# EAGLE design Sensor_Projekt_board_fertig_V1004 (EAGLE 9.6.1)

## Sheet 1 of 11: Spannungsversorgung
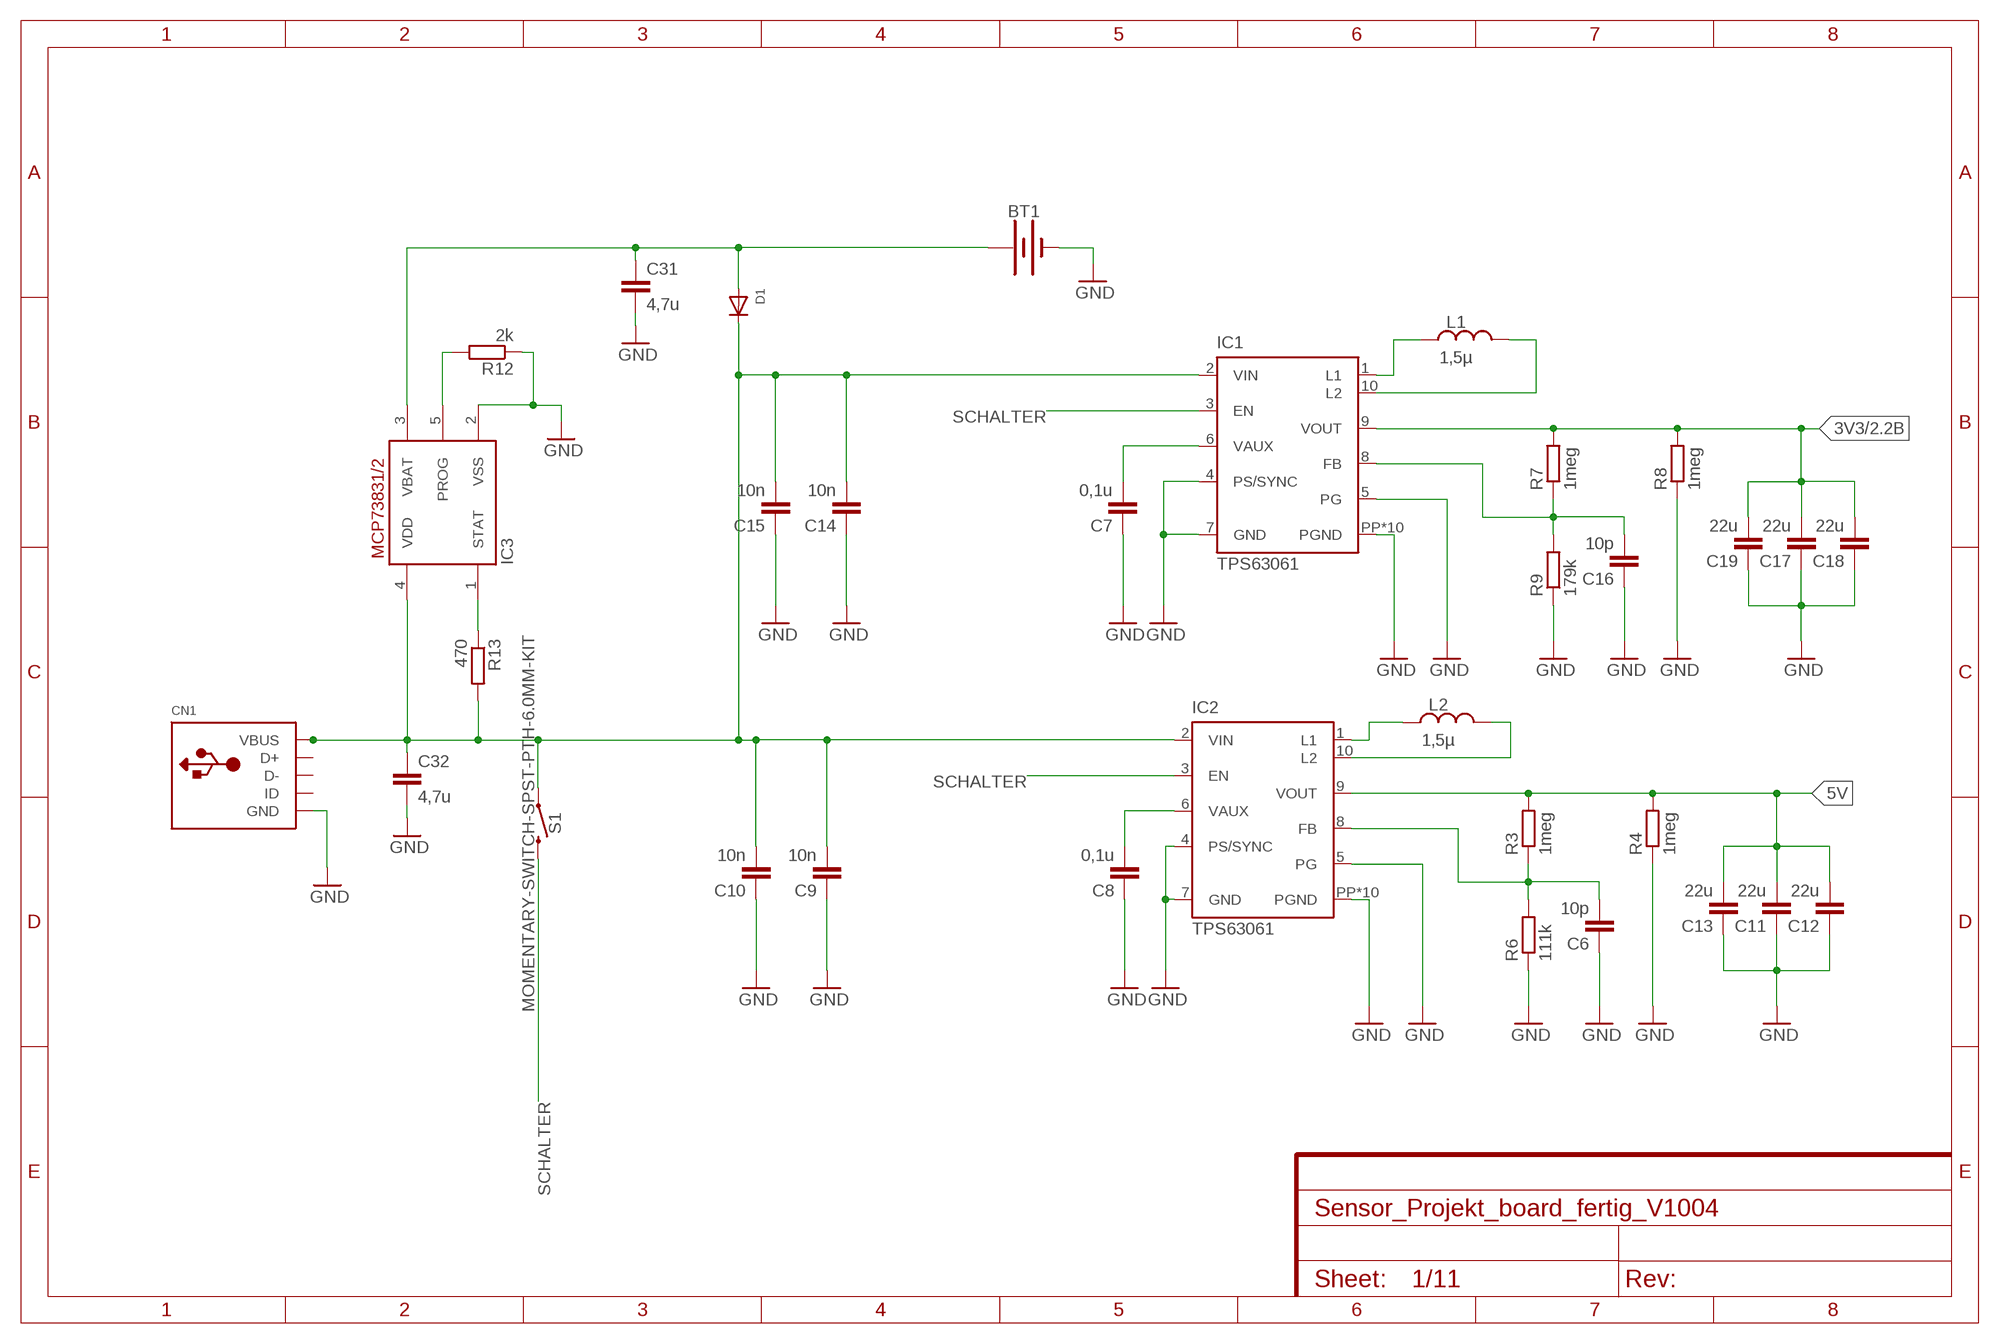
[diagram p0: schematic, sheet 1]

### Parts
BT1  BATTERY-18650  [BATTERY_18650-HOLDER]
C6  10p  C-EUC0603  [C0603]
C7  0,1u  C-EUC0603  [C0603]
C8  0,1u  C-EUC0603  [C0603]
C9  10n  C-EUC0603  [C0603]
C10  10n  C-EUC0603  [C0603]
C11  22u  C-EUC0603  [C0603]
C12  22u  C-EUC0603  [C0603]
C13  22u  C-EUC0603  [C0603]
C14  10n  C-EUC0603  [C0603]
C15  10n  C-EUC0603  [C0603]
C16  10p  C-EUC0603  [C0603]
C17  22u  C-EUC0603  [C0603]
C18  22u  C-EUC0603  [C0603]
C19  22u  C-EUC0603  [C0603]
C31  4,7u  C-EUC0603  [C0603]
C32  4,7u  C-EUC0603  [C0603]
CN1  USBTHM  [USB-MINIB-THM]
D1  DIODE_SOD-123FL  [SOD-123FL]
IC1  TPS63061  [DSC-S-PWSON-N10]
IC2  TPS63061  [DSC-S-PWSON-N10]
IC3  MCP73831/OT  [SOT23-5L]
L1  1,5µ  L_CHIP-1008(2520-METRIC)  [INDC2520X120N]
L2  1,5µ  L_CHIP-1008(2520-METRIC)  [INDC2520X120N]
R3  1meg  R-EU_R0603  [R0603]
R4  1meg  R-EU_R0603  [R0603]
R6  111k  R-EU_R0603  [R0603]
R7  1meg  R-EU_R0603  [R0603]
R8  1meg  R-EU_R0603  [R0603]
R9  179k  R-EU_R0603  [R0603]
R12  2k  R-EU_R0603  [R0603]
R13  470  R-EU_R0603  [R0603]
S1  MOMENTARY-SWITCH-SPST-PTH-6.0MM-KIT  [TACTILE_SWITCH_PTH_6.0MM_KIT]

### Nets
3V3: C17.2 C18.2 C19.2 IC1.9(VOUT) R7.2 R8.2 ; also sheet 2,3,4,5,7,8,11
5V: C11.2 C12.2 C13.2 IC2.9(VOUT) R3.2 R4.2 ; also sheet 6,9,10
GND: BT1.GND@1(-) C6.1 C7.1 C8.1 C9.1 C10.1 C11.1 C12.1 C13.1 C14.1 C15.1 C16.1 C17.1 C18.1 C19.1 C31.2 C32.2 CN1.GND IC1.4(PS/SYNC) IC1.7(GND) IC1.PP(PGND) IC1.PP@1(PGND) IC1.PP@2(PGND) IC1.PP@3(PGND) IC1.PP@4(PGND) IC1.PP@5(PGND) IC1.PP@7(PGND) IC1.PP@8(PGND) IC1.PP@9(PGND) IC1.PP@10(PGND) IC2.4(PS/SYNC) IC2.5(PG) IC2.7(GND) IC2.PP(PGND) IC2.PP@1(PGND) IC2.PP@2(PGND) IC2.PP@3(PGND) IC2.PP@4(PGND) IC2.PP@5(PGND) IC2.PP@7(PGND) IC2.PP@8(PGND) IC2.PP@9(PGND) IC2.PP@10(PGND) IC3.2(VSS) R4.1 R6.1 R8.1 R9.1 R12.1 ; also sheet 2,3,4,5,6,7,8,9,10,11
N$2: IC3.5(PROG) R12.2
N$3: BT1.PWR@1(+) C31.1 D1.A IC3.3(VBAT)
N$4: C8.2 IC2.6(VAUX)
N$5: C7.2 IC1.6(VAUX)
N$6: C9.2 C10.2 C14.2 C15.2 C32.1 CN1.VBUS D1.C IC1.2(VIN) IC2.2(VIN) IC3.4(VDD) R13.2 S1.1
N$7: IC2.10(L2) L2.2
N$8: IC1.1(L1) L1.1
N$9: IC1.10(L2) L1.2
N$10: C6.2 IC2.8(FB) R3.1 R6.2
N$11: C16.2 IC1.8(FB) R7.1 R9.2
N$12: IC1.5(PG) ; supply symbol labelled GND
N$13: IC2.1(L1) L2.1
N$14: IC3.1(STAT) R13.1
SCHALTER: IC1.3(EN) IC2.3(EN) S1.3 ; also sheet 2
Unconnected: CN1.D+ CN1.D- CN1.ID

## Sheet 2 of 11: ESP32
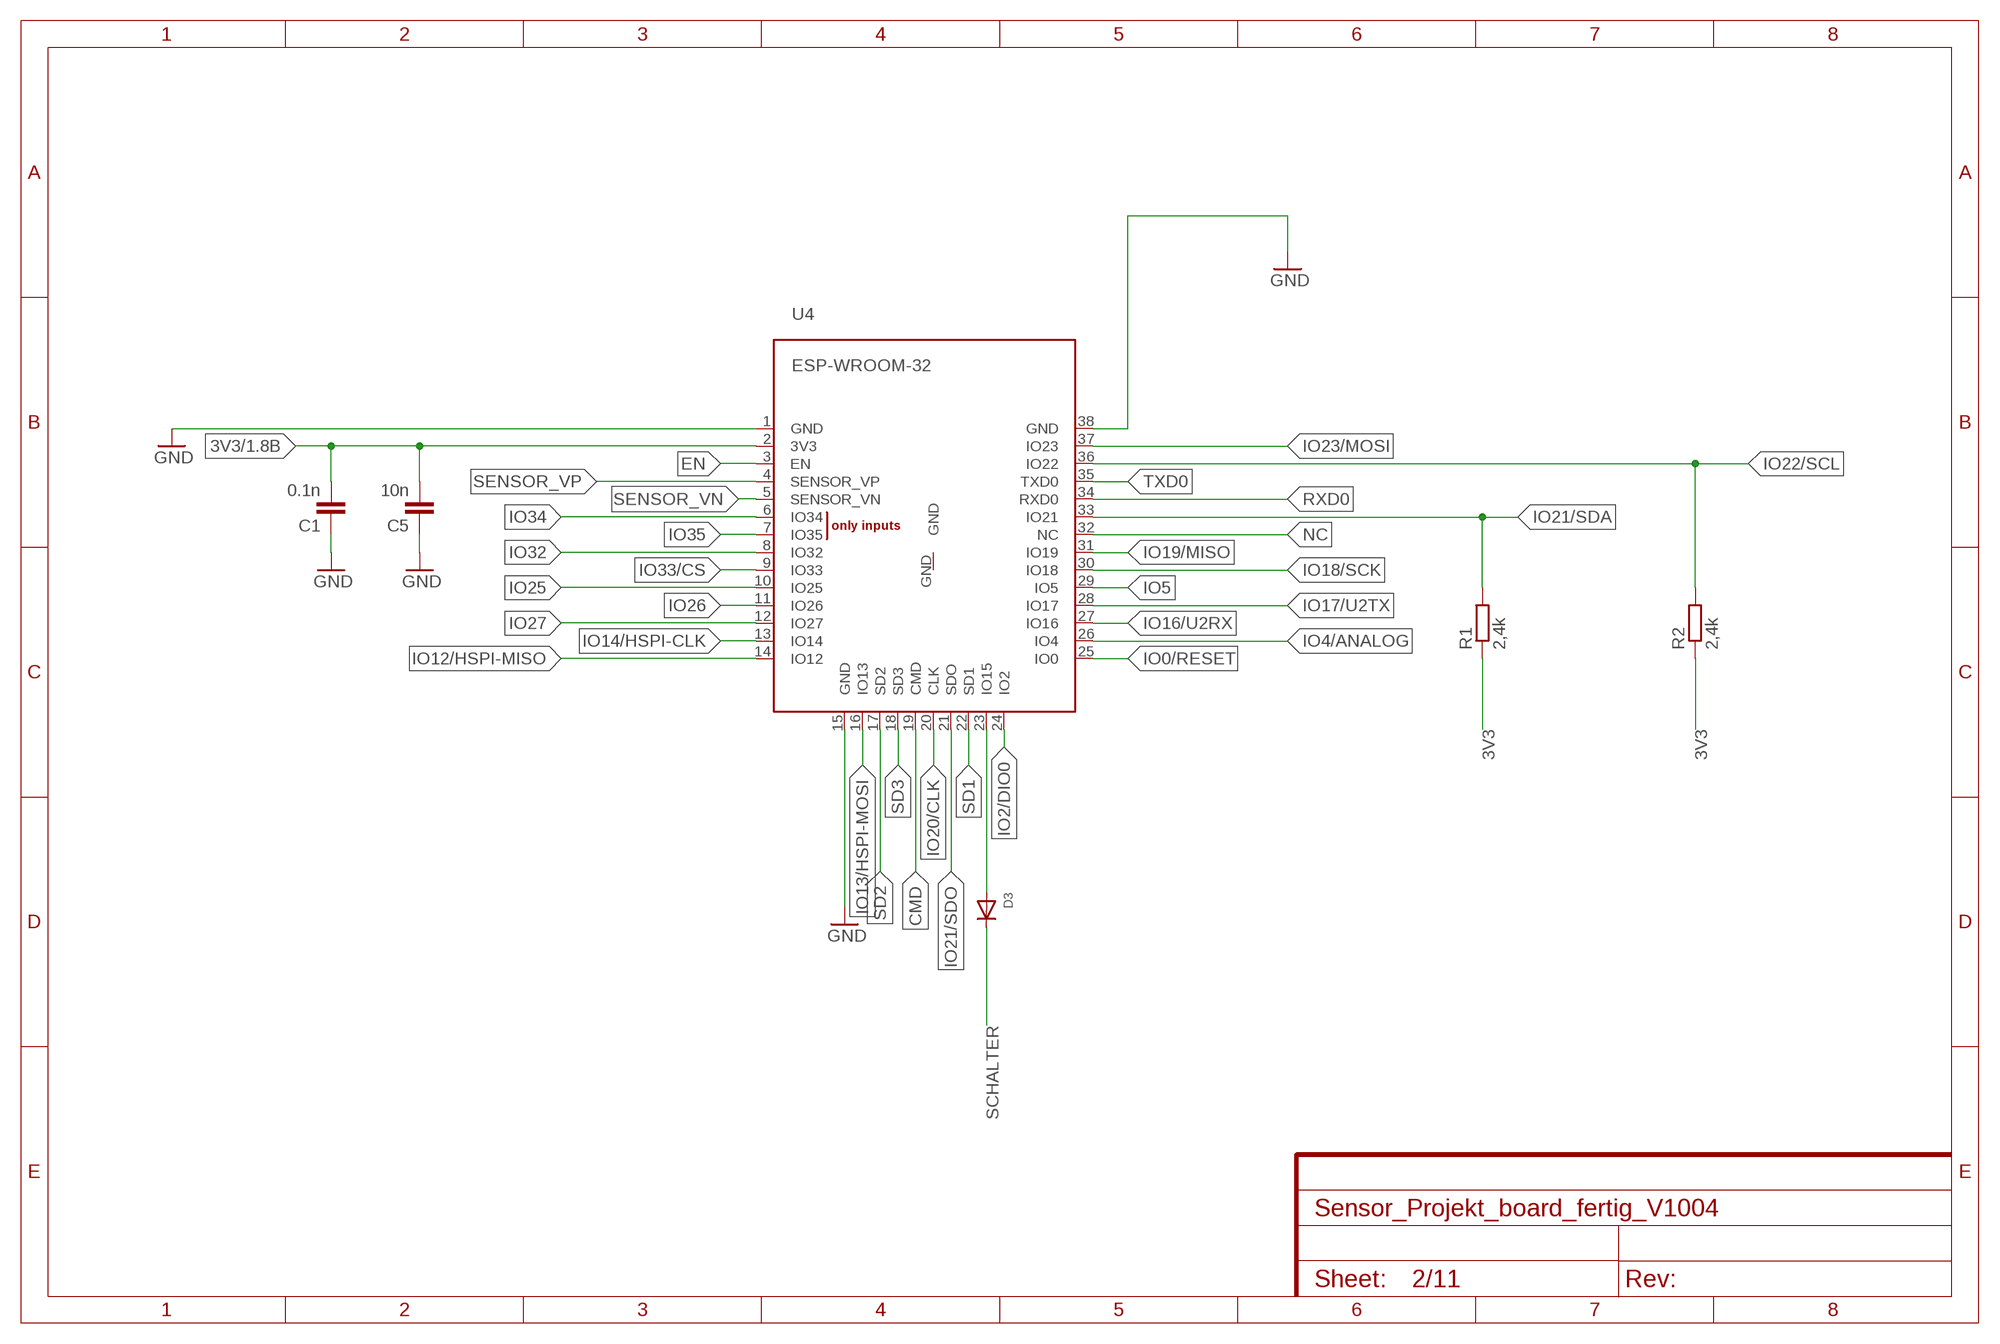
[diagram p1: schematic, sheet 2]

### Parts
C1  0.1n  C-EUC0603  [C0603]
C5  10n  C-EUC0603  [C0603]
D3  DIODE_SOD-123FL  [SOD-123FL]
R1  2,4k  R-EU_R0603  [R0603]
R2  2,4k  R-EU_R0603  [R0603]
U4  ESP-WROOM-32  [ESP-WROOM-32]

### Nets
3V3: C1.2 C5.2 R1.1 R2.1 U4.2(3V3) ; also sheet 1,3,4,5,7,8,11
CMD: U4.19(CMD)
EN: U4.3(EN)
GND: C1.1 C5.1 U4.1(GND) U4.15(GND) U4.38(GND) ; also sheet 1,3,4,5,6,7,8,9,10,11
IO0/RESET: U4.25(IO0) ; also sheet 7
IO2/DIO0: U4.24(IO2) ; also sheet 7
IO4/ANALOG: U4.26(IO4) ; also sheet 6
IO5: U4.29(IO5) ; also sheet 7
IO12/HSPI-MISO: U4.14(IO12) ; also sheet 8
IO13/HSPI-MOSI: U4.16(IO13) ; also sheet 8
IO14/HSPI-CLK: U4.13(IO14) ; also sheet 8
IO15/VCC_ENABLE: D3.A U4.23(IO15)
IO16/U2RX: U4.27(IO16) ; also sheet 9
IO17/U2TX: U4.28(IO17)
IO18/SCK: U4.30(IO18) ; also sheet 7
IO19/MISO: U4.31(IO19) ; also sheet 7
IO20/CLK: U4.20(CLK)
IO21/SDA: R1.2 U4.33(IO21) ; also sheet 3,5,10,11
IO21/SDO: U4.21(SDO)
IO22/SCL: R2.2 U4.36(IO22) ; also sheet 3,5,10,11
IO23/MOSI: U4.37(IO23) ; also sheet 7
IO25: U4.10(IO25)
IO26: U4.11(IO26)
IO27: U4.12(IO27)
IO32: U4.8(IO32)
IO33/CS: U4.9(IO33) ; also sheet 8
IO34: U4.6(IO34)
IO35: U4.7(IO35)
NC: U4.32(NC)
RXD0: U4.34(RXD0) ; also sheet 4
SCHALTER: D3.C ; also sheet 1
SD1: U4.22(SD1)
SD2: U4.17(SD2)
SD3: U4.18(SD3)
SENSOR_VN: U4.5(SENSOR_VN)
SENSOR_VP: U4.4(SENSOR_VP)
TXD0: U4.35(TXD0) ; also sheet 4
Unconnected: U4.GND

## Sheet 3 of 11: Temp-Hum-Pres-BME280
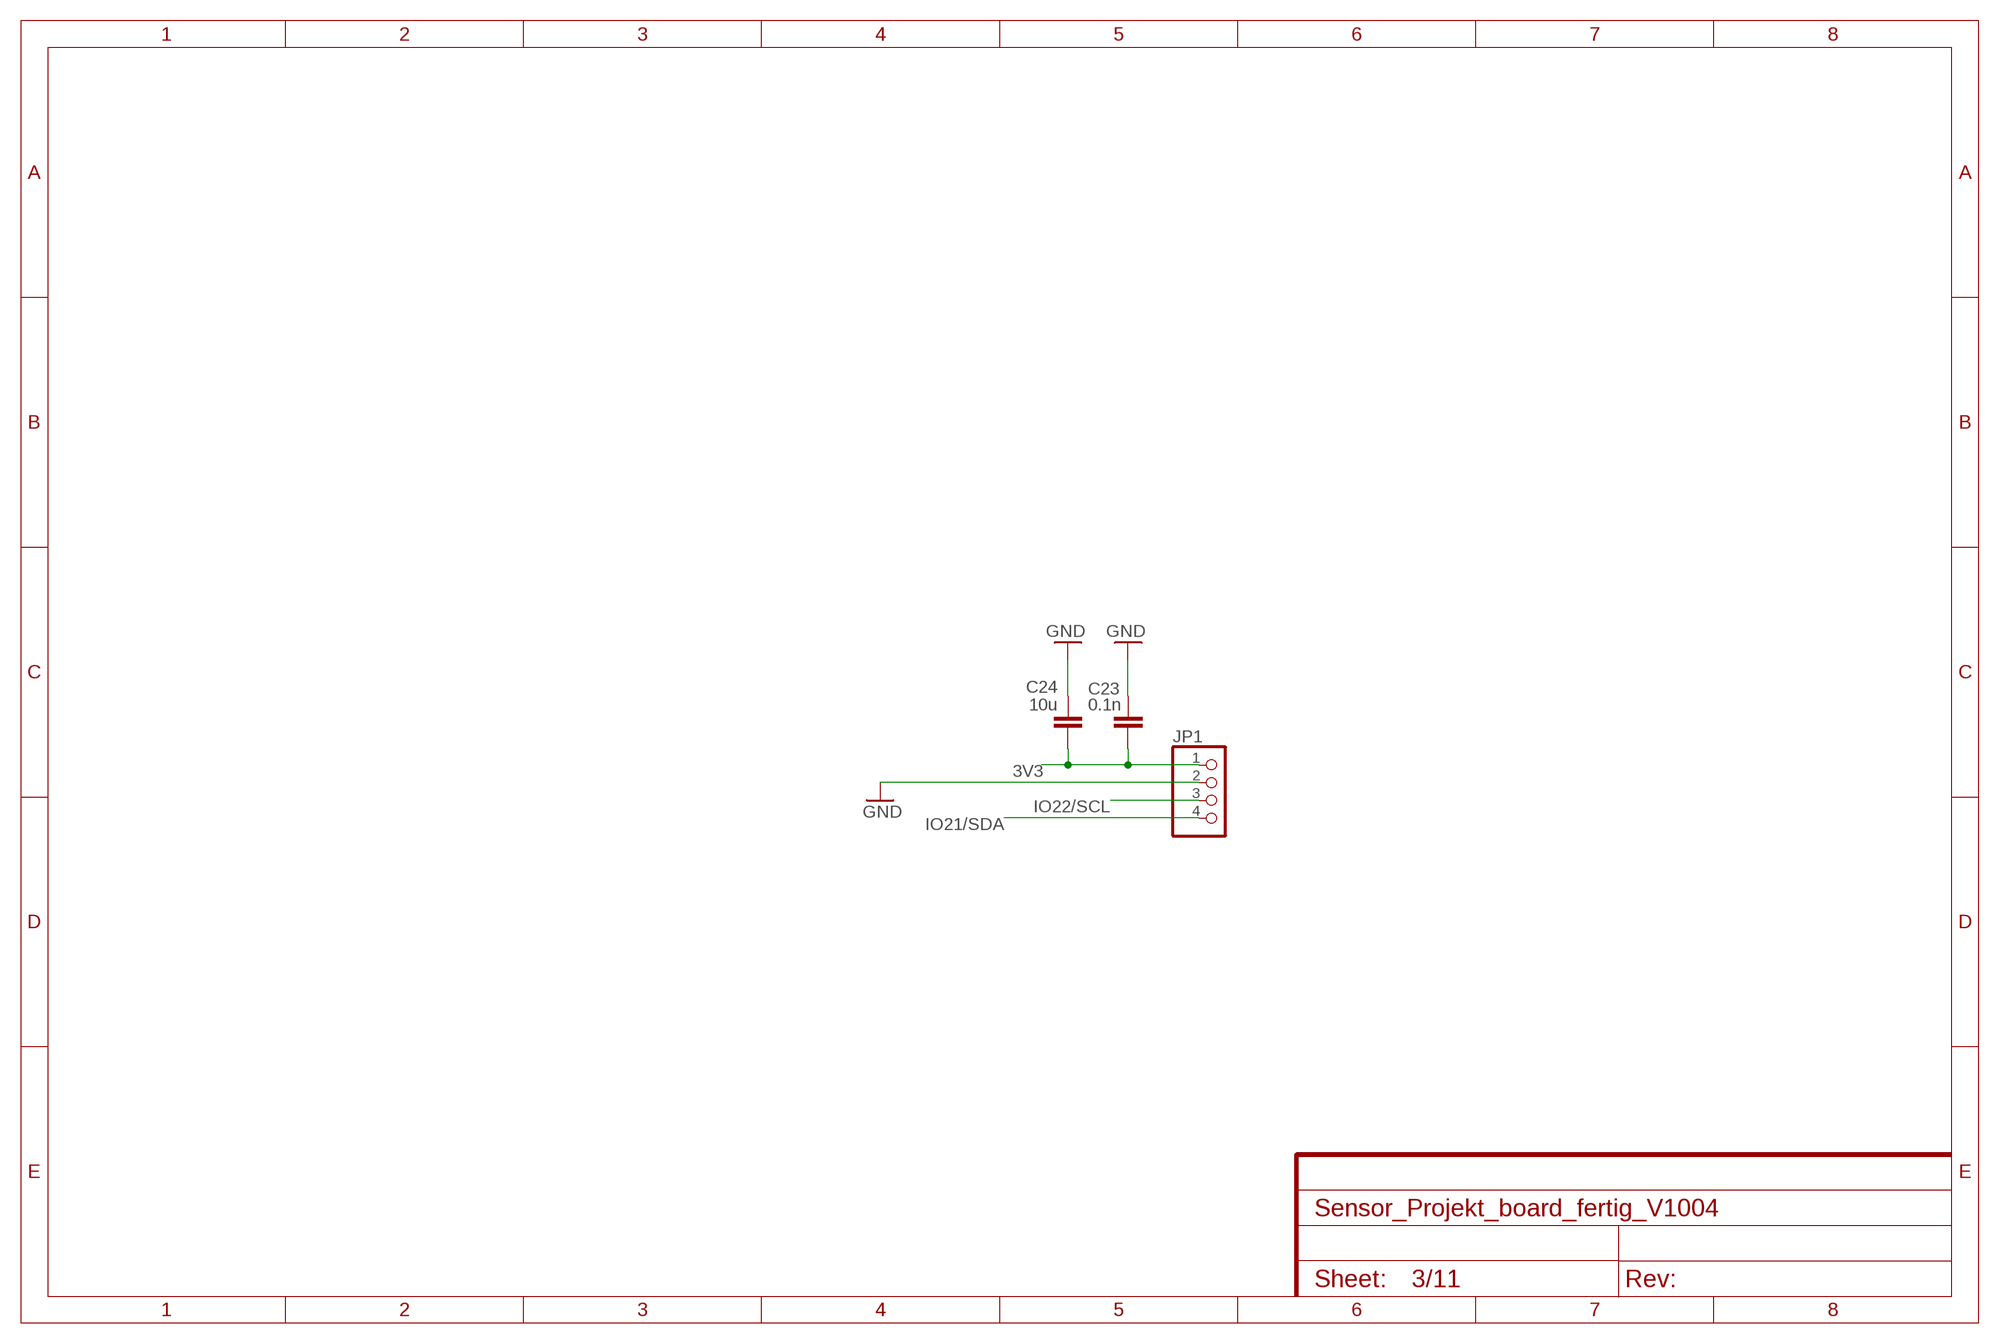
[diagram p2: schematic, sheet 3]

### Parts
C23  0.1n  C-EUC0603  [C0603]
C24  10u  C-EUC0603  [C0603]
JP1  PINHD-1X4  [1X04]

### Nets
3V3: C23.1 C24.1 JP1.1 ; also sheet 1,2,4,5,7,8,11
GND: C23.2 C24.2 JP1.2 ; also sheet 1,2,4,5,6,7,8,9,10,11
IO21/SDA: JP1.4 ; also sheet 2,5,10,11
IO22/SCL: JP1.3 ; also sheet 2,5,10,11

## Sheet 4 of 11: USB_Anschluss
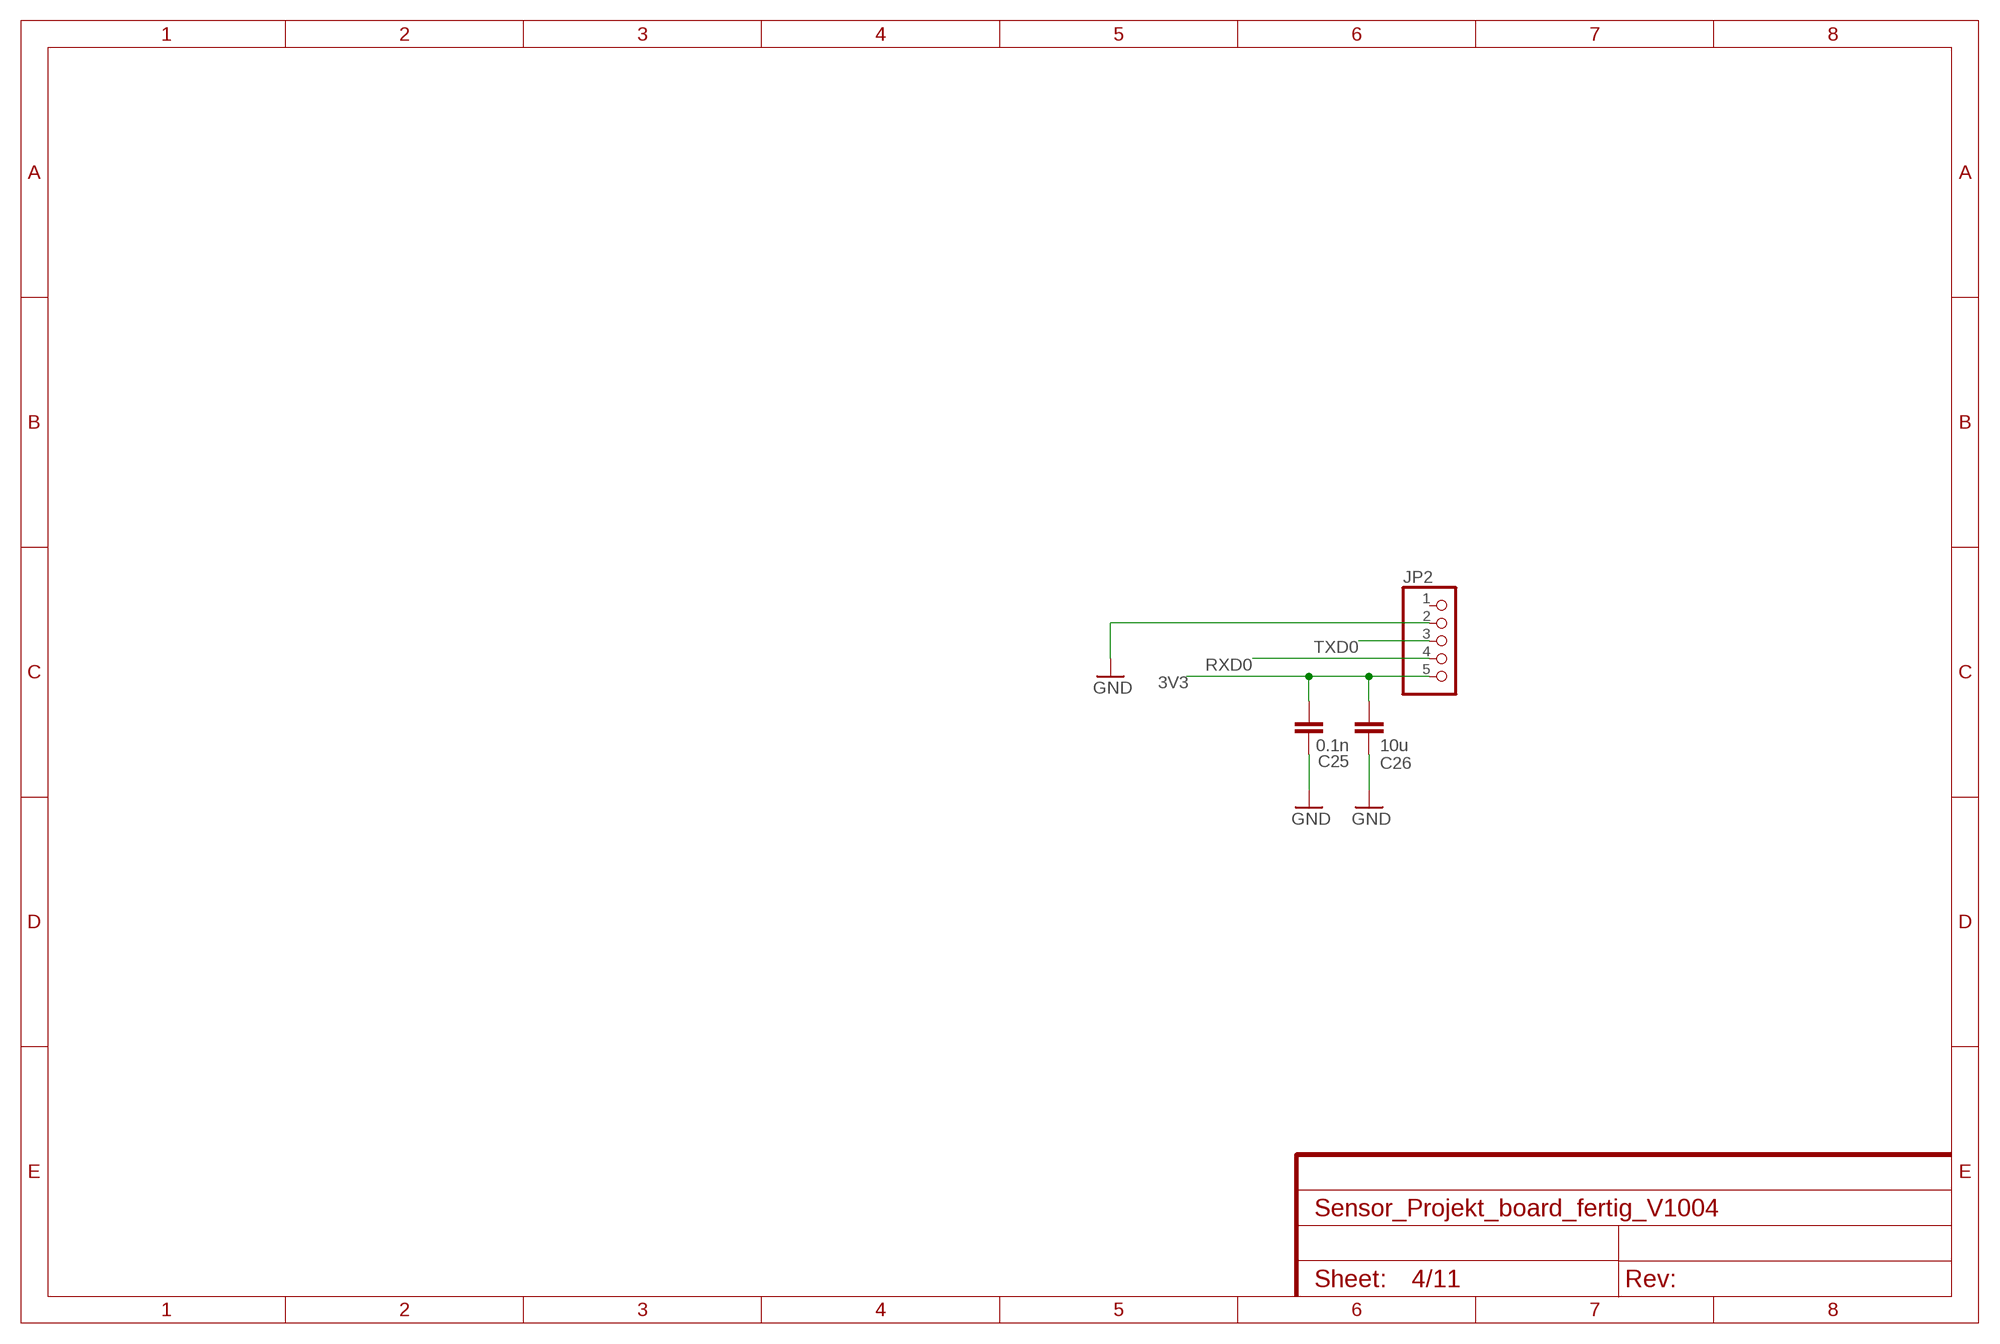
[diagram p3: schematic, sheet 4]

### Parts
C25  0.1n  C-EUC0603  [C0603]
C26  10u  C-EUC0603  [C0603]
JP2  PINHD-1X5  [1X05]

### Nets
3V3: C25.1 C26.1 JP2.5 ; also sheet 1,2,3,5,7,8,11
GND: C25.2 C26.2 JP2.2 ; also sheet 1,2,3,5,6,7,8,9,10,11
RXD0: JP2.4 ; also sheet 2
TXD0: JP2.3 ; also sheet 2
Unconnected: JP2.1

## Sheet 5 of 11: Display
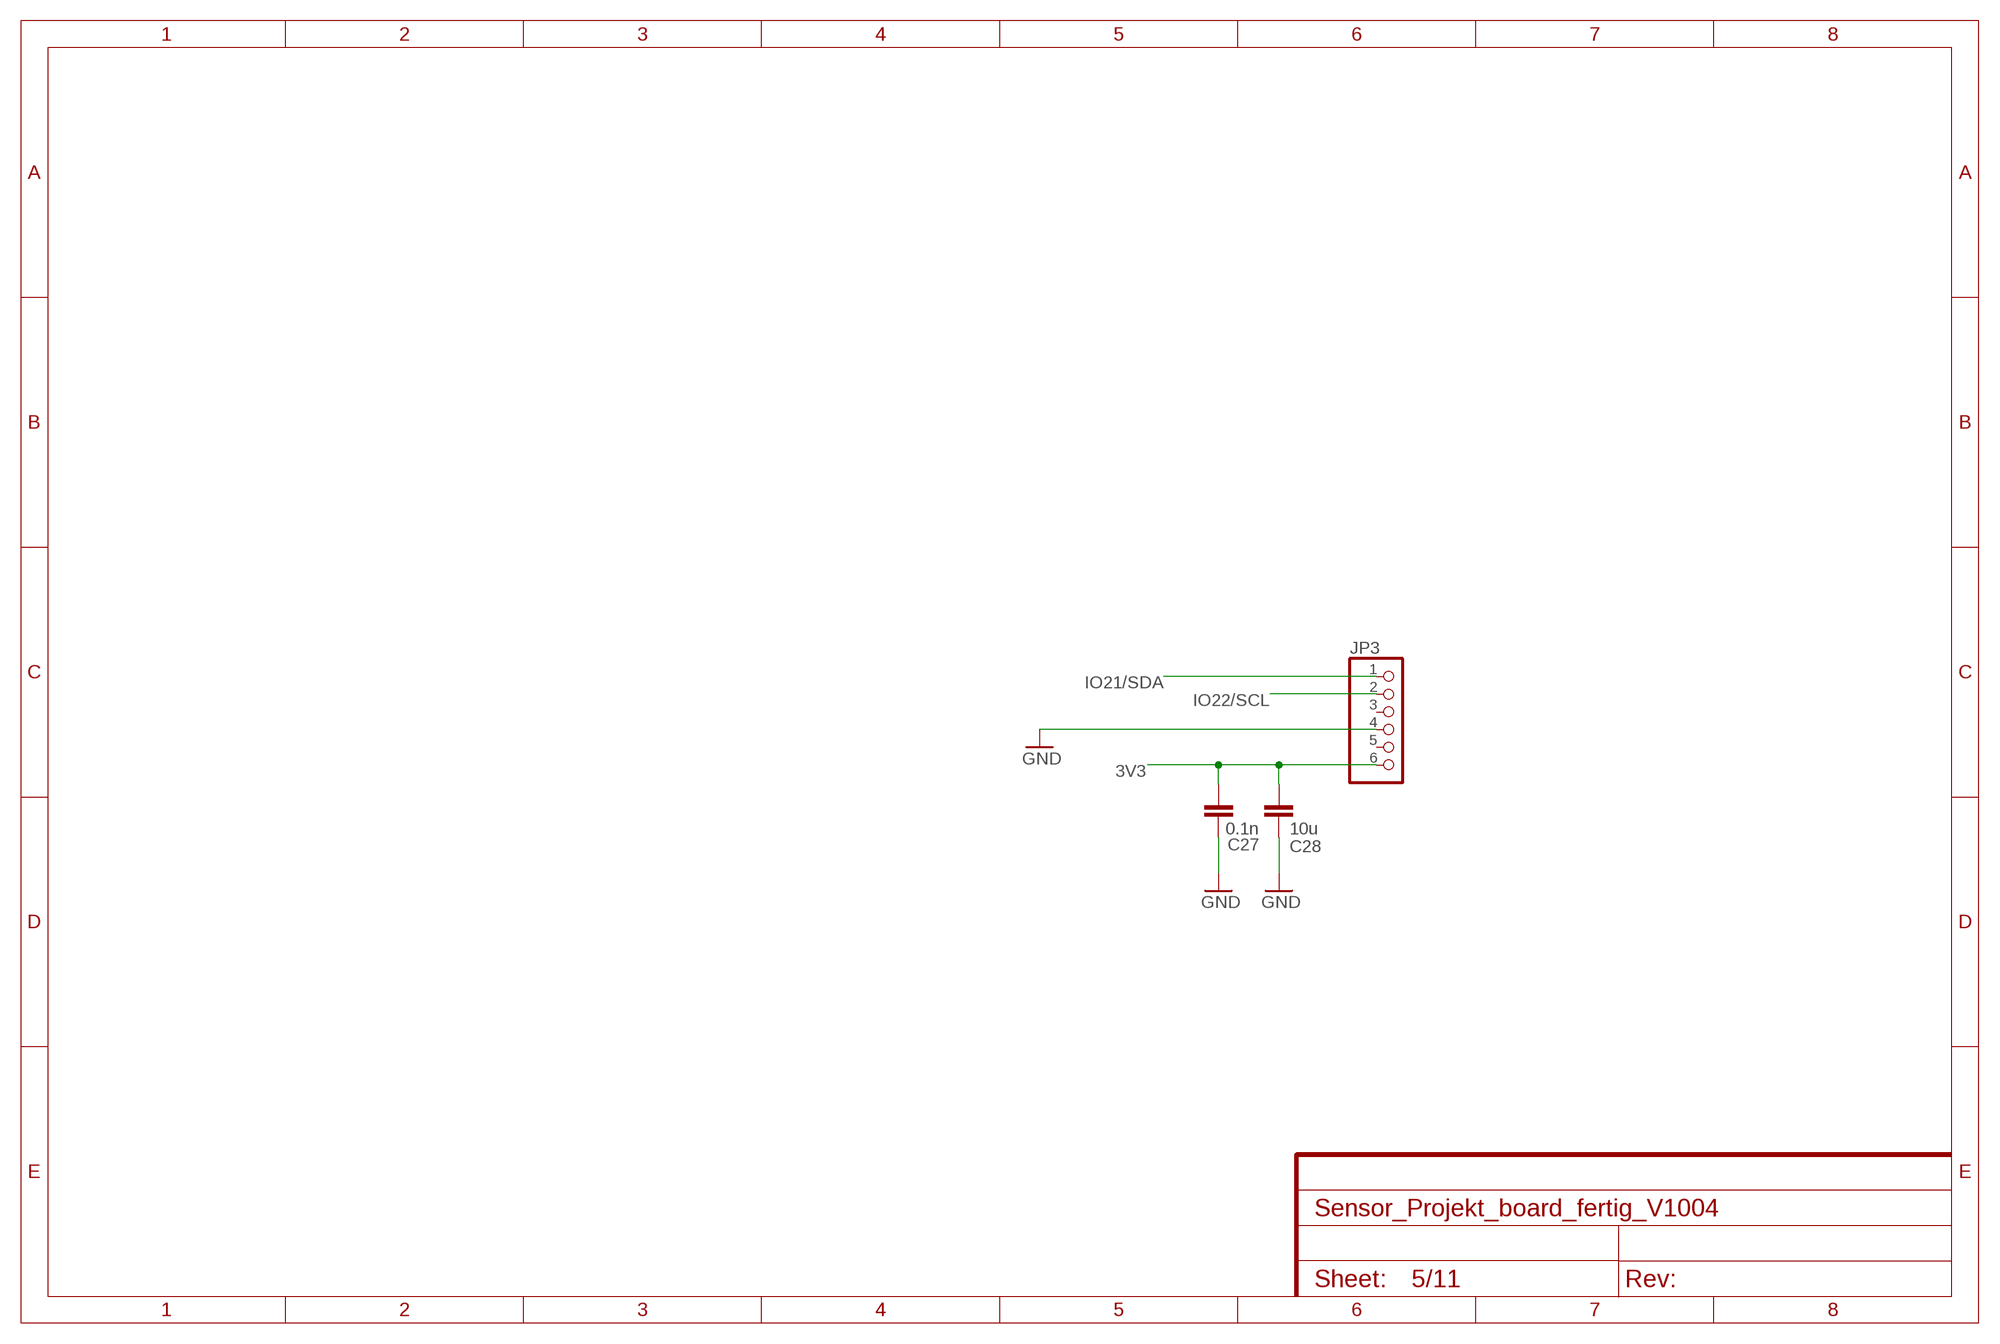
[diagram p4: schematic, sheet 5]

### Parts
C27  0.1n  C-EUC0603  [C0603]
C28  10u  C-EUC0603  [C0603]
JP3  PINHD-1X6  [1X06]

### Nets
3V3: C27.1 C28.1 JP3.6 ; also sheet 1,2,3,4,7,8,11
GND: C27.2 C28.2 JP3.4 ; also sheet 1,2,3,4,6,7,8,9,10,11
IO21/SDA: JP3.1 ; also sheet 2,3,10,11
IO22/SCL: JP3.2 ; also sheet 2,3,10,11
Unconnected: JP3.3 JP3.5

## Sheet 6 of 11: Gassensor MQ135
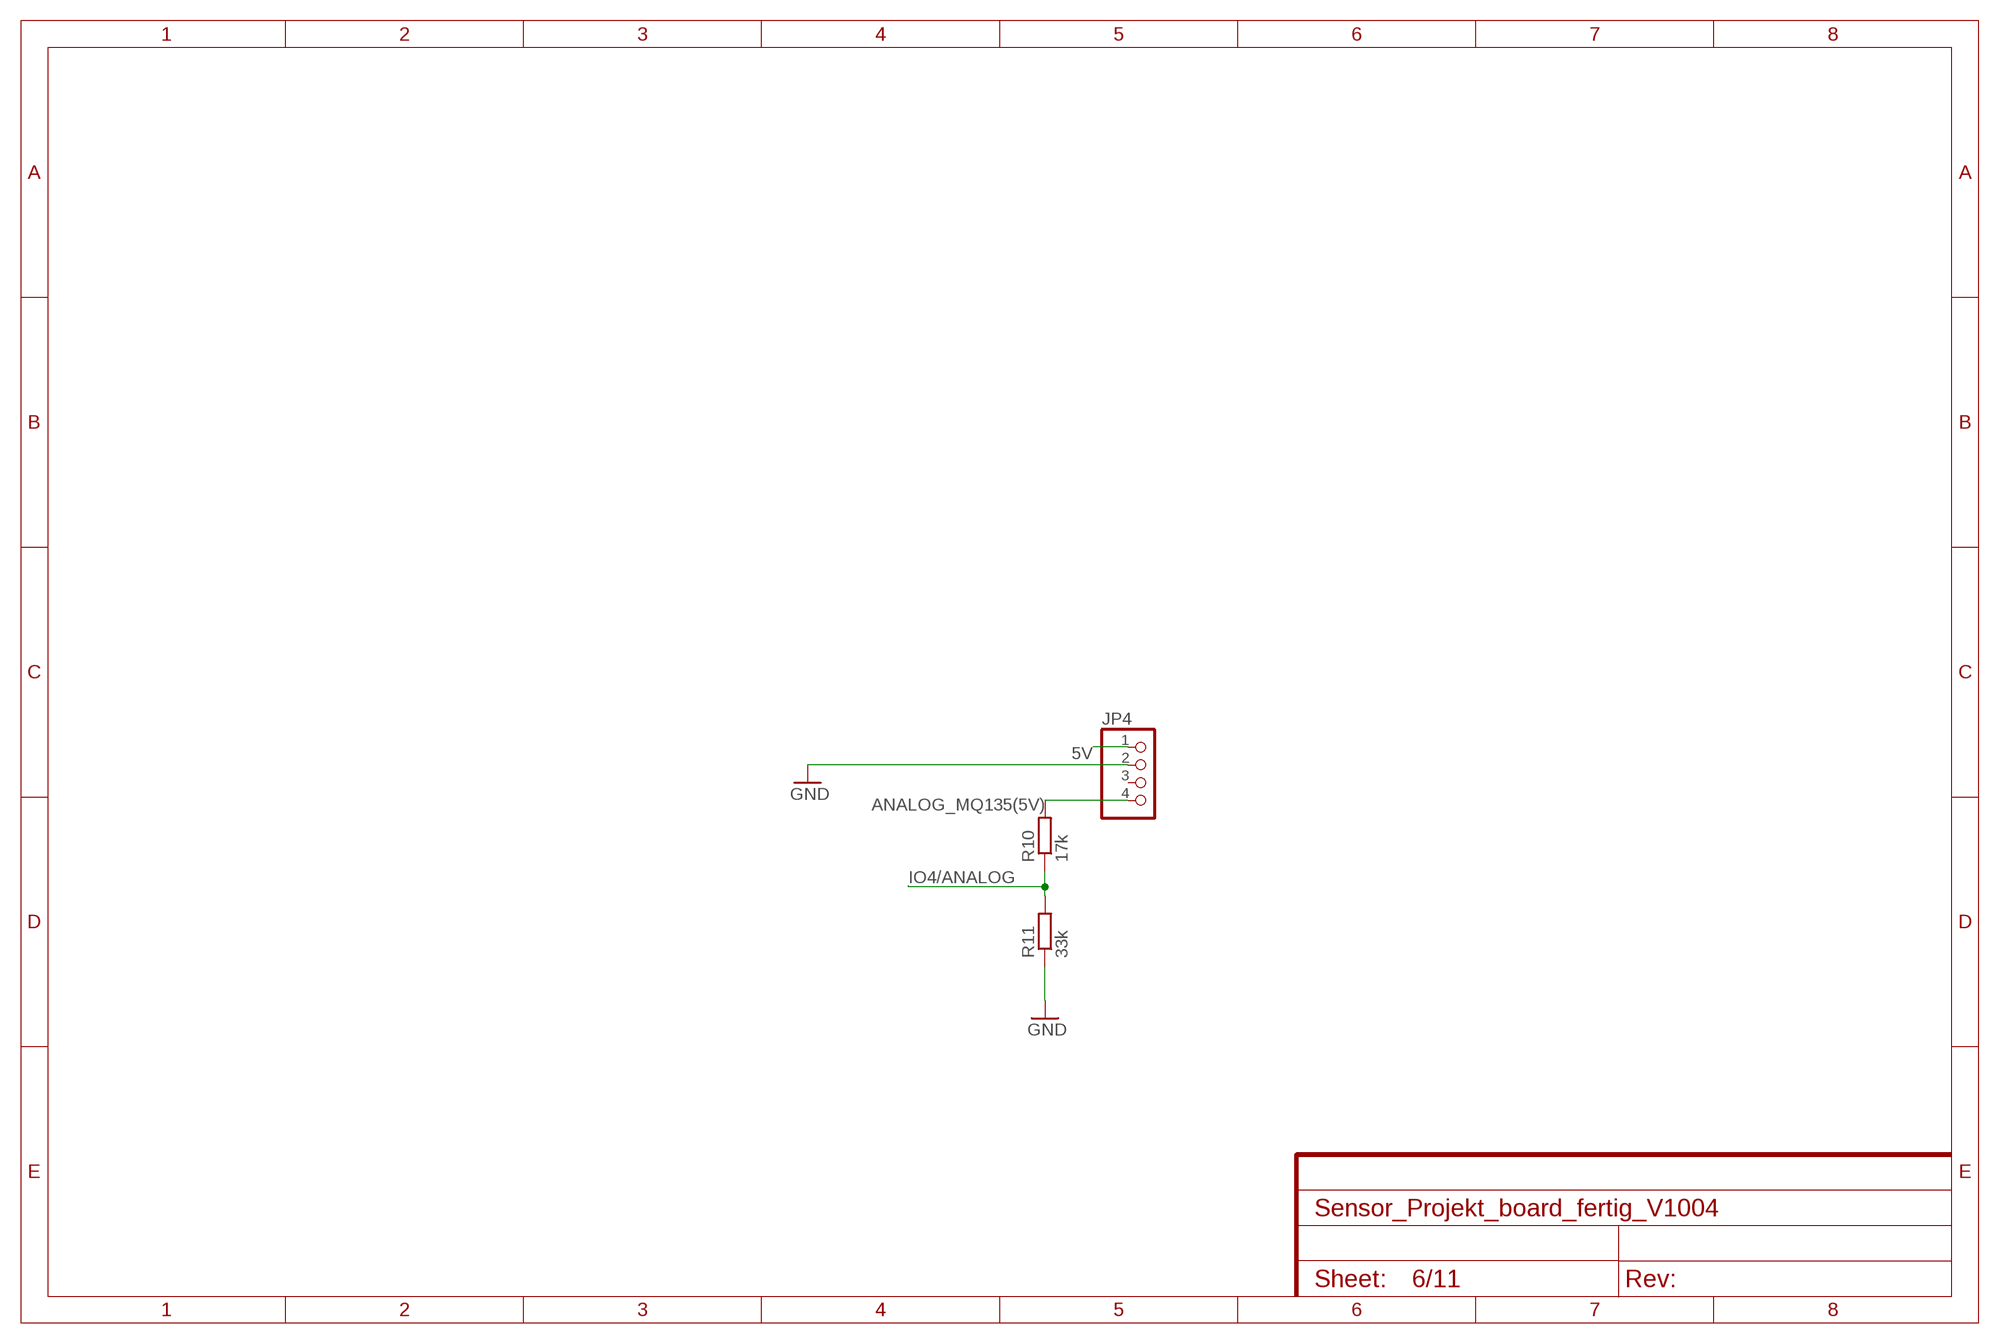
[diagram p5: schematic, sheet 6]

### Parts
JP4  PINHD-1X4  [1X04]
R10  17k  R-EU_R0603  [R0603]
R11  33k  R-EU_R0603  [R0603]

### Nets
5V: JP4.1 ; also sheet 1,9,10
ANALOG_MQ135(5V): JP4.4 R10.2
GND: JP4.2 R11.1 ; also sheet 1,2,3,4,5,7,8,9,10,11
IO4/ANALOG: R10.1 R11.2 ; also sheet 2
Unconnected: JP4.3

## Sheet 7 of 11: LORA-Modul
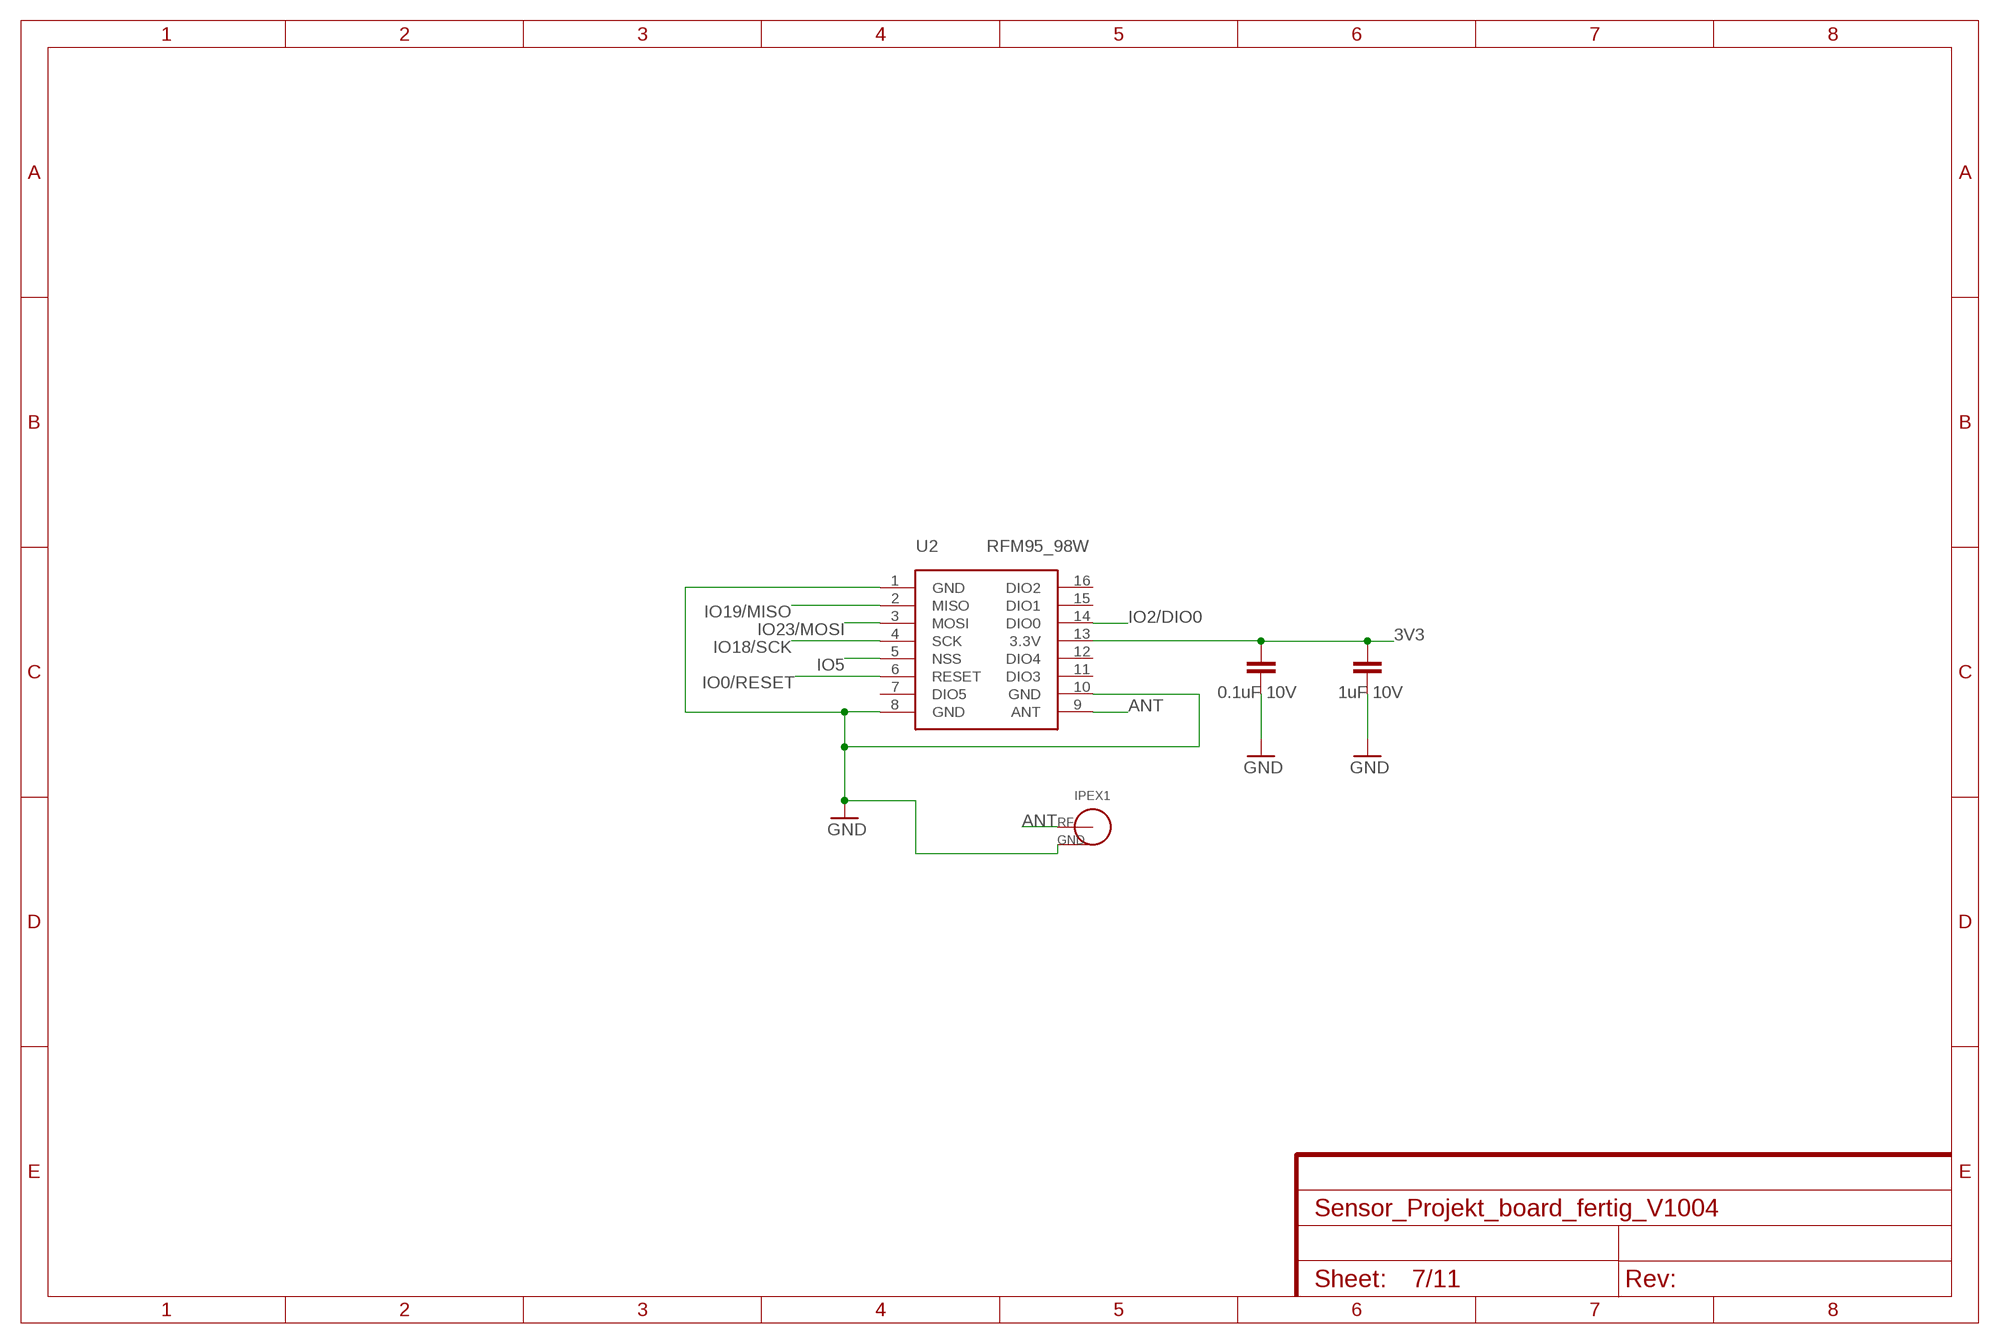
[diagram p6: schematic, sheet 7]

### Parts
C4  0.1uF 10V  C-EUC0402  [C0402]
C20  1uF 10V  C-EUC0402  [C0402]
IPEX1  I-PEX  [I-PEX]
U2  RFM95_98W  [RFM95_98W]

### Nets
3V3: C4.2 C20.2 U2.13(3.3V) ; also sheet 1,2,3,4,5,8,11
ANT: IPEX1.SIG U2.9(ANT)
GND: C4.1 C20.1 IPEX1.GND IPEX1.GND1(GND) U2.1(GND) U2.8(GND) U2.10(GND) ; also sheet 1,2,3,4,5,6,8,9,10,11
IO0/RESET: U2.6(RESET) ; also sheet 2
IO2/DIO0: U2.14(DIO0) ; also sheet 2
IO5: U2.5(NSS) ; also sheet 2
IO18/SCK: U2.4(SCK) ; also sheet 2
IO19/MISO: U2.2(MISO) ; also sheet 2
IO23/MOSI: U2.3(MOSI) ; also sheet 2
Unconnected: U2.7(DIO5) U2.11(DIO3) U2.12(DIO4) U2.15(DIO1) U2.16(DIO2)

## Sheet 8 of 11: SD-Karte
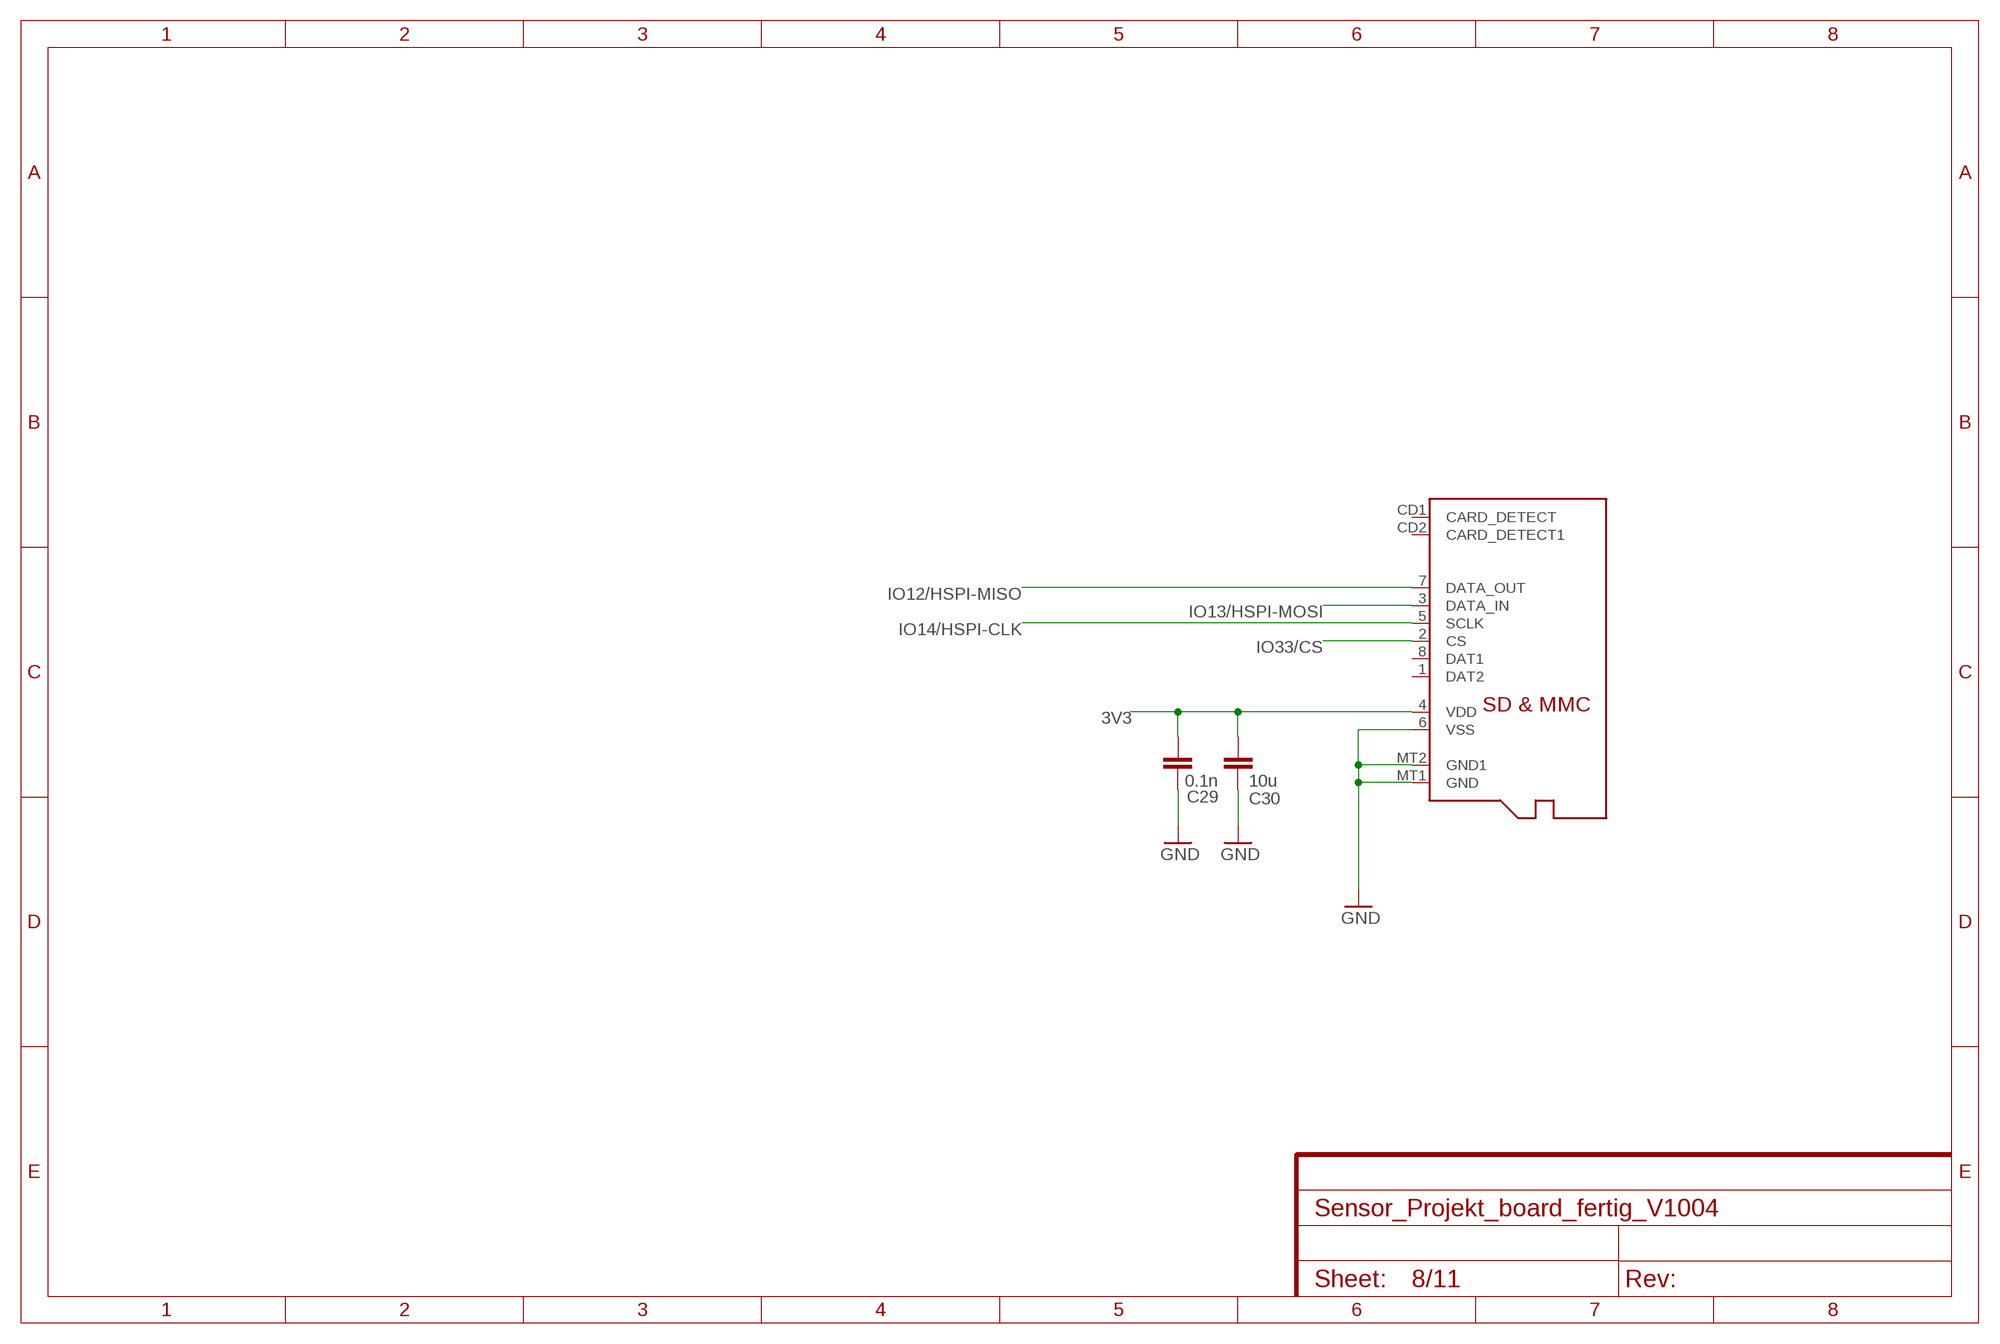
[diagram p7: schematic, sheet 8]

### Parts
C29  0.1n  C-EUC0603  [C0603]
C30  10u  C-EUC0603  [C0603]
U$16  MICROSD  [MICROSD]

### Nets
3V3: C29.1 C30.1 U$16.4(VDD) ; also sheet 1,2,3,4,5,7,11
GND: C29.2 C30.2 U$16.6(VSS) U$16.MT1(GND) U$16.MT2(GND1) ; also sheet 1,2,3,4,5,6,7,9,10,11
IO12/HSPI-MISO: U$16.7(DATA_OUT) ; also sheet 2
IO13/HSPI-MOSI: U$16.3(DATA_IN) ; also sheet 2
IO14/HSPI-CLK: U$16.5(SCLK) ; also sheet 2
IO33/CS: U$16.2(CS) ; also sheet 2
Unconnected: U$16.1(DAT2) U$16.8(DAT1) U$16.CD1(CARD_DETECT) U$16.CD2(CARD_DETECT1)

## Sheet 9 of 11: Feinstaubsensor
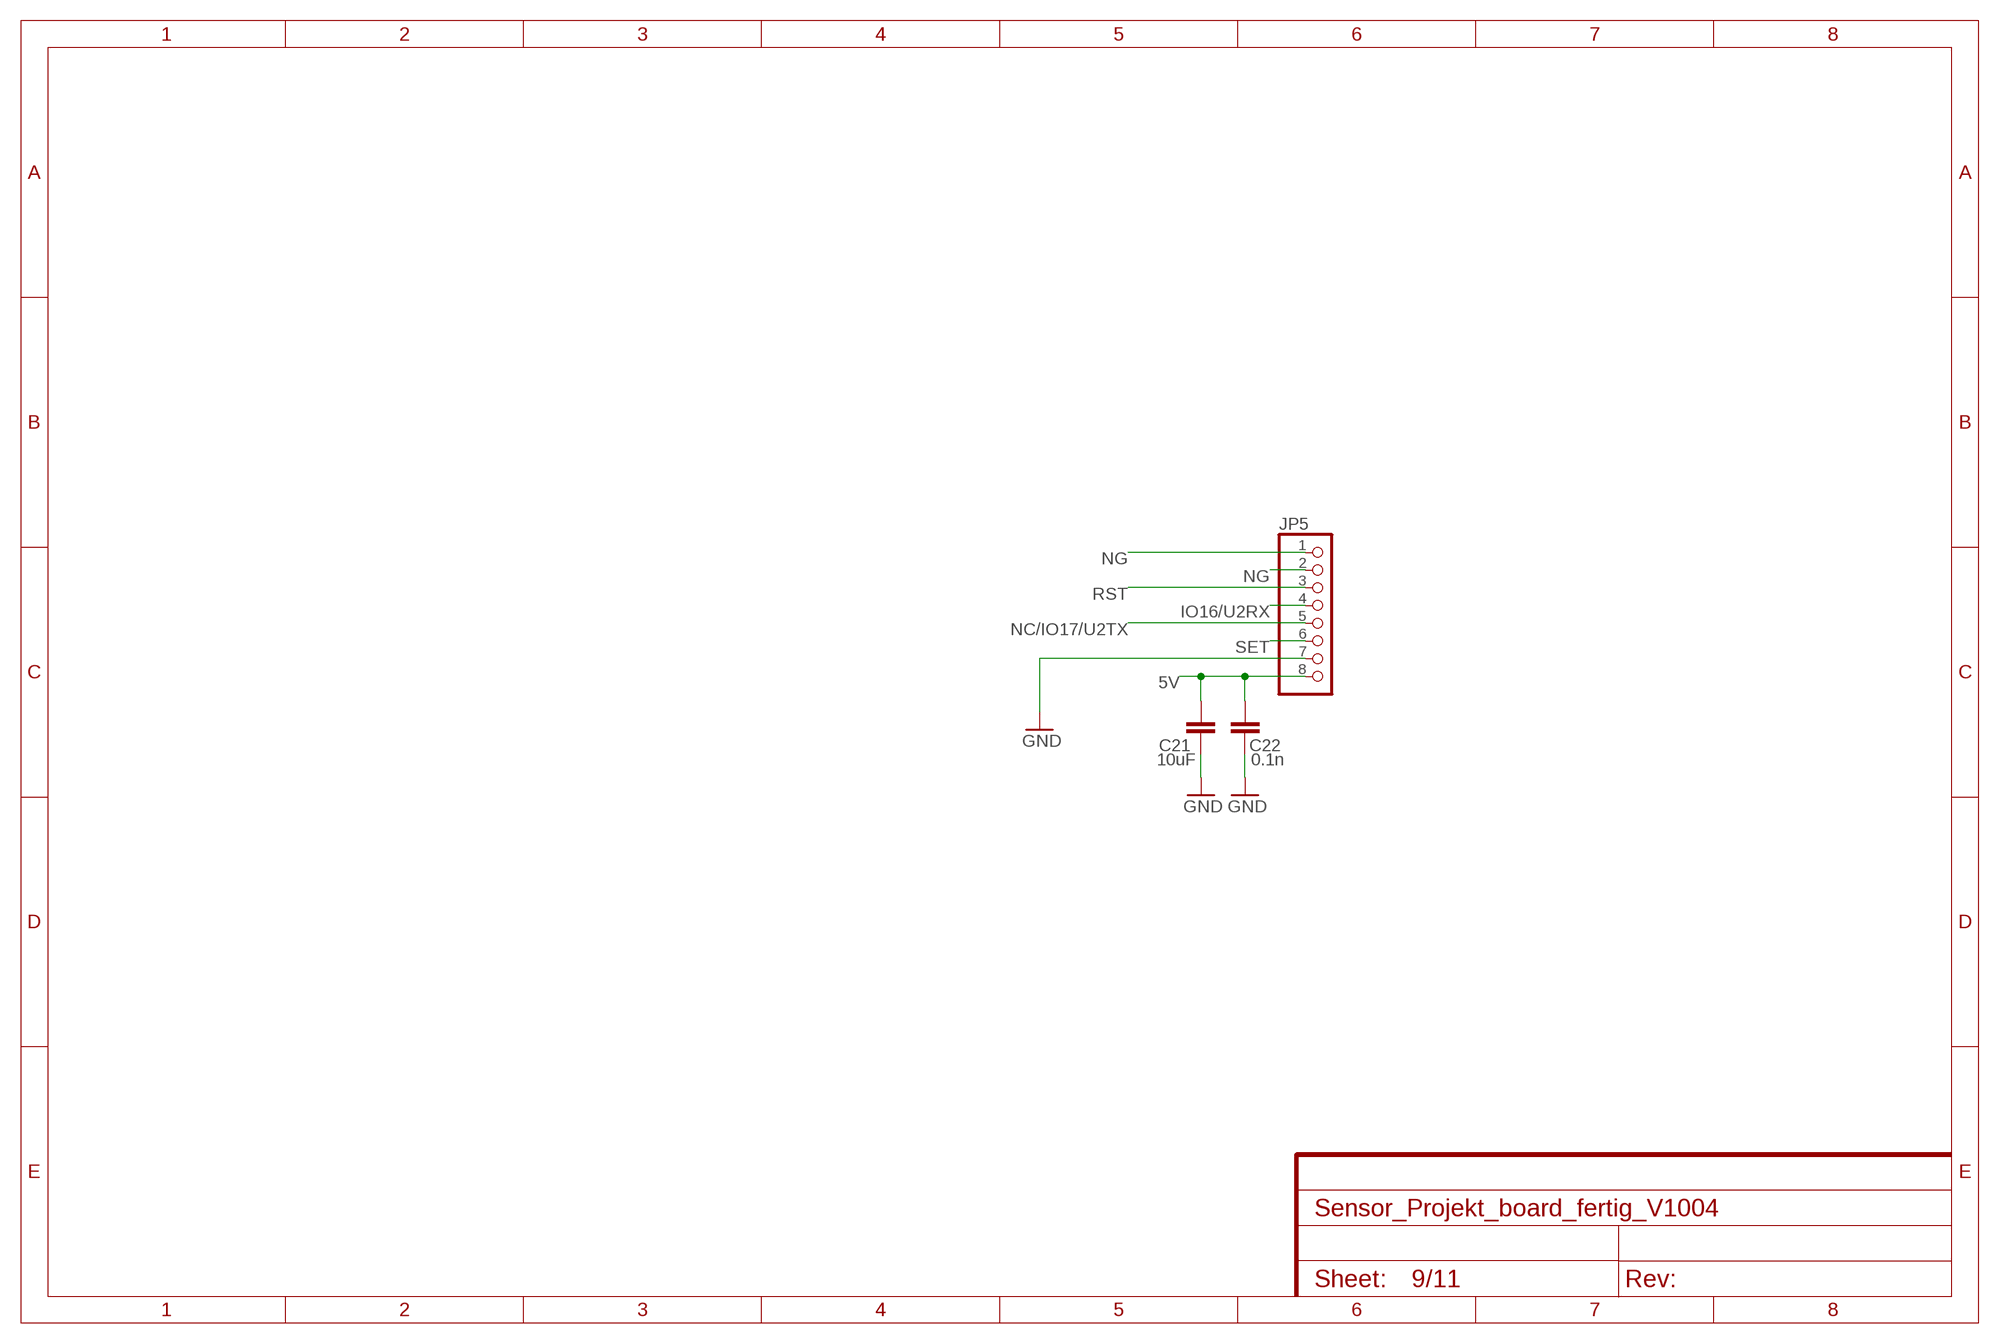
[diagram p8: schematic, sheet 9]

### Parts
C21  10uF  10UF-0805-10V-10%  [0805]
C22  0.1n  C-EUC0603  [C0603]
JP5  PINHD-1X8  [1X08]

### Nets
5V: C21.2 C22.2 JP5.8 ; also sheet 1,6,10
GND: C21.1 C22.1 JP5.7 ; also sheet 1,2,3,4,5,6,7,8,10,11
IO16/U2RX: JP5.4 ; also sheet 2
NC/IO17/U2TX: JP5.5
NG: JP5.1 JP5.2
RST: JP5.3
SET: JP5.6

## Sheet 10 of 11: CO2-Sensor
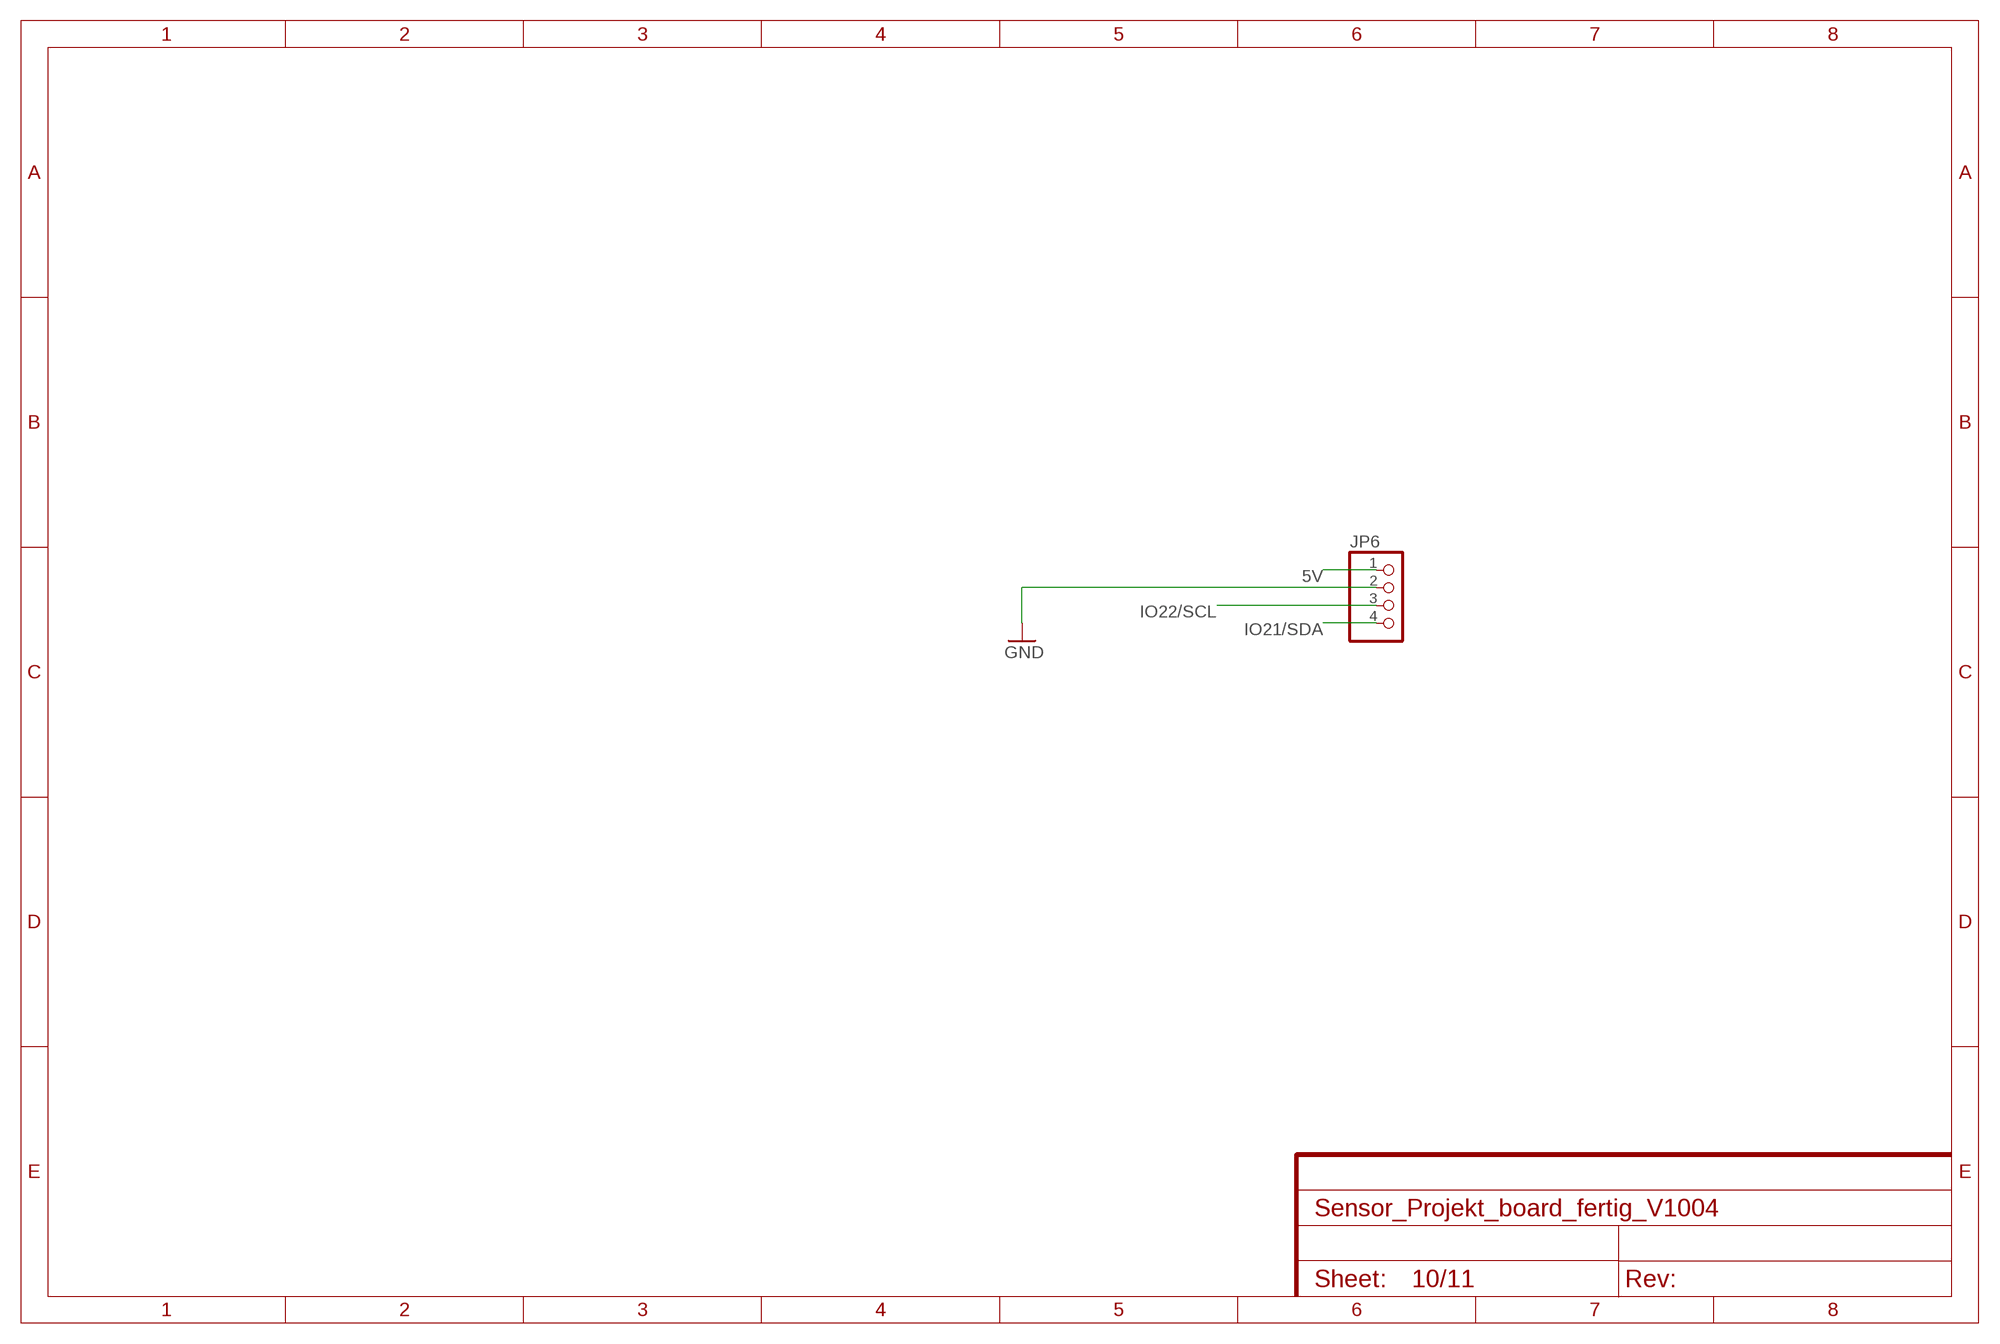
[diagram p9: schematic, sheet 10]

### Parts
JP6  PINHD-1X4  [1X04]

### Nets
5V: JP6.1 ; also sheet 1,6,9
GND: JP6.2 ; also sheet 1,2,3,4,5,6,7,8,9,11
IO21/SDA: JP6.4 ; also sheet 2,3,5,11
IO22/SCL: JP6.3 ; also sheet 2,3,5,11

## Sheet 11 of 11: Echtzeituhr
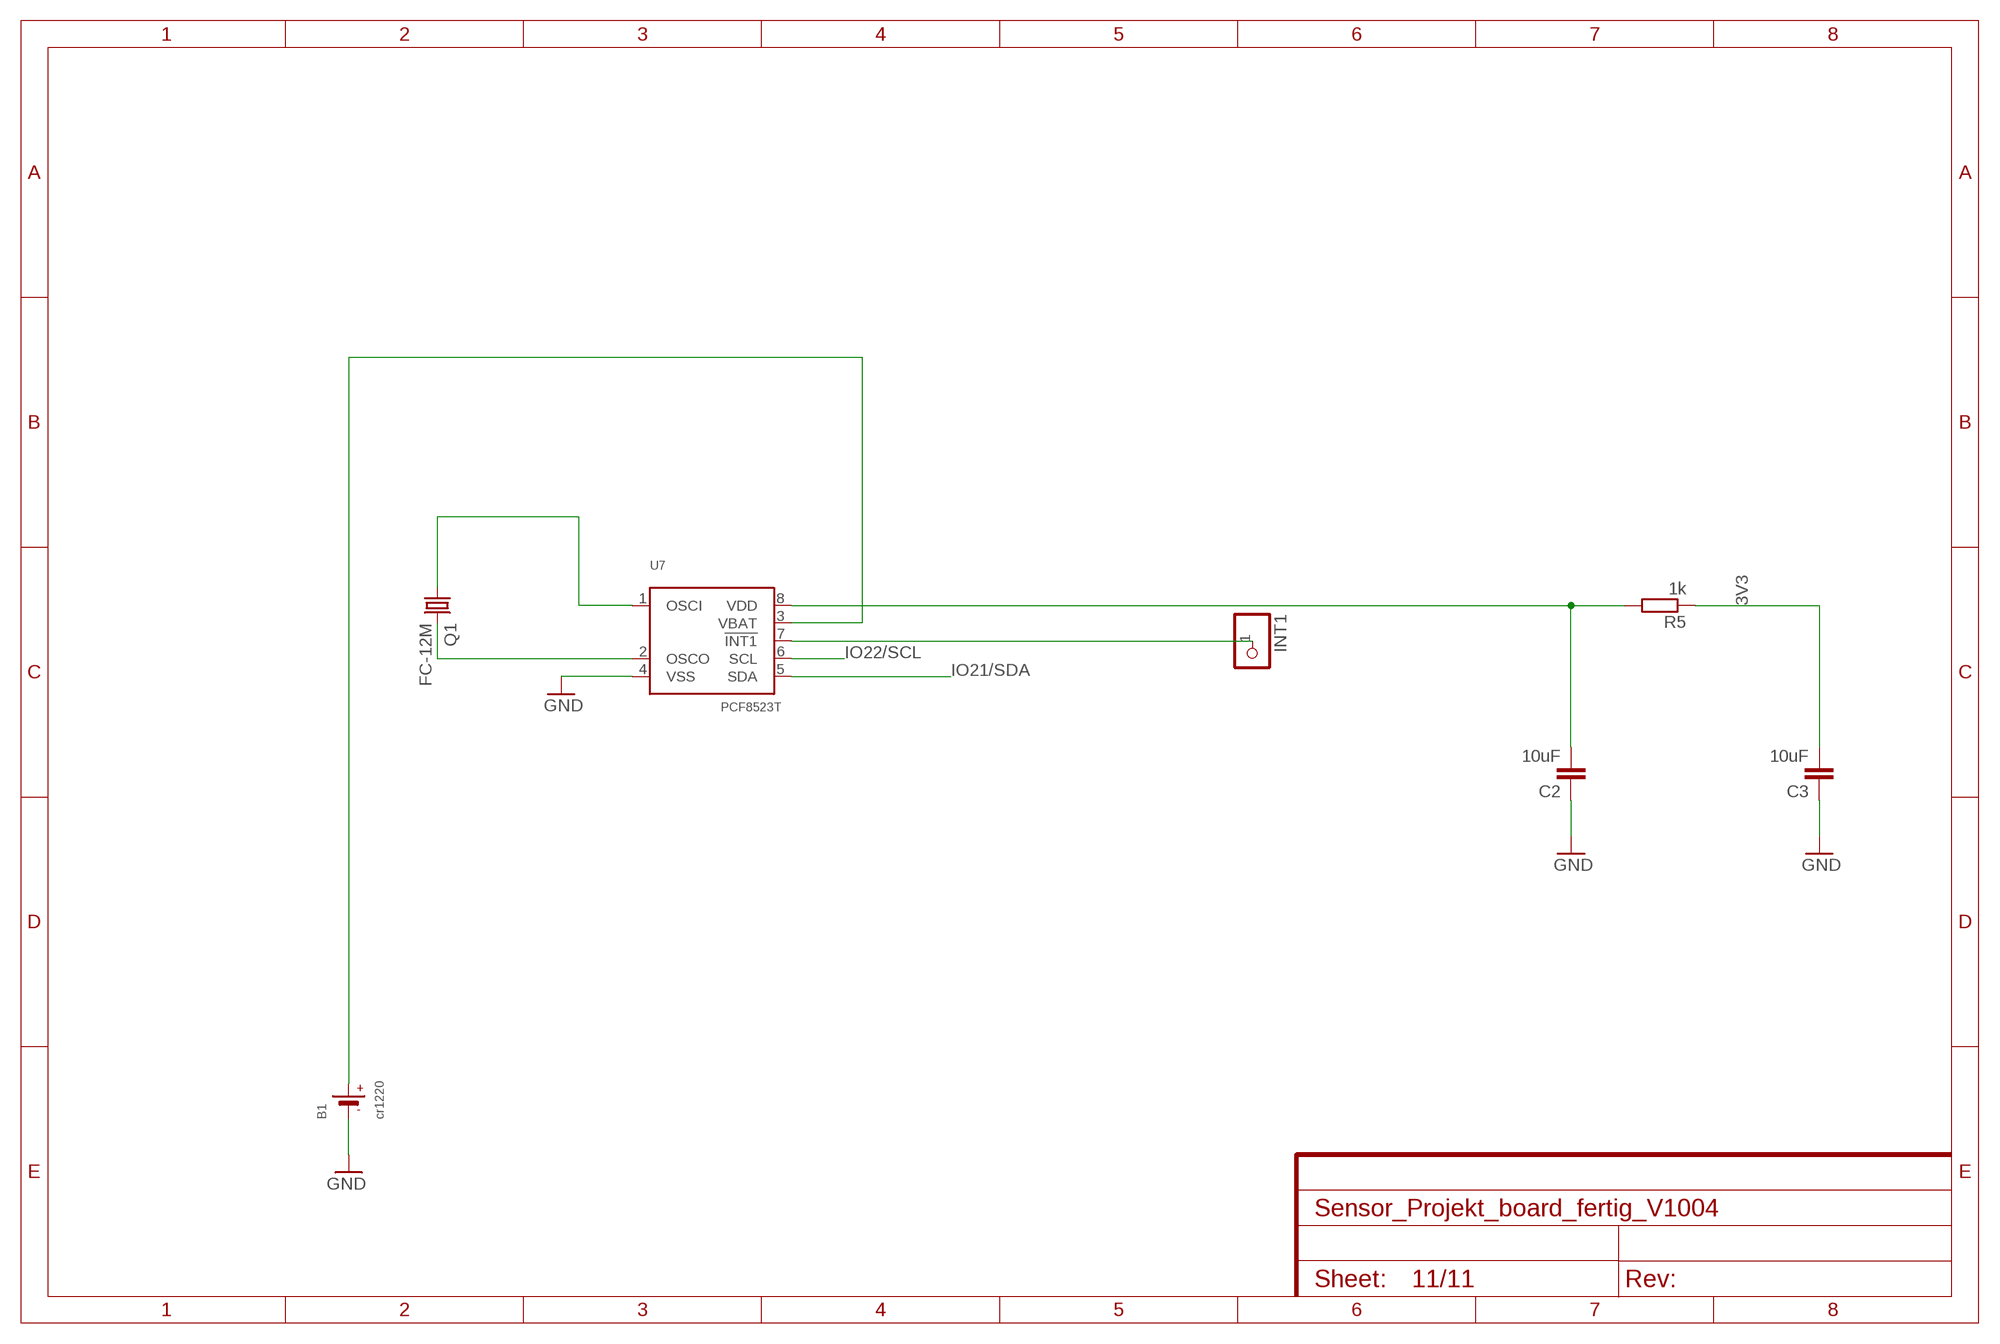
[diagram p10: schematic, sheet 11]

### Parts
B1  cr1220  BATTERYCR1220_2  [CR1220-2]
C2  10uF  10UF-0805-10V-10%  [0805]
C3  10uF  10UF-0805-10V-10%  [0805]
INT1  HEADER-1X1ROUND  [1X01_ROUND]
Q1  FC-12M  [FC-12M]
R5  1k  R-EU_R0603  [R0603]
U7  PCF8523T  [SOT96-1]

### Nets
3V3: C3.2 R5.1 ; also sheet 1,2,3,4,5,7,8
GND: B1.- C2.1 C3.1 U7.4(VSS) ; also sheet 1,2,3,4,5,6,7,8,9,10
IO21/SDA: U7.5(SDA) ; also sheet 2,3,5,10
IO22/SCL: U7.6(SCL) ; also sheet 2,3,5,10
N$1: INT1.1 U7.7(!INT1)
N$24: Q1.1 U7.1(OSCI)
N$28: Q1.2 U7.2(OSCO)
N$30: B1.+ U7.3(VBAT)
N$31: C2.2 R5.2 U7.8(VDD)

## Library data of the parts
B1 = microbuilder:BATTERY: CR1220 SMT - Digikey: 3001K-ND CD2032 BAT-HLD-001 - Digikey: BAT-HLD-001-ND
BT1 = SparkFun-Batteries:BATTERY: Battery - Single Cell A variety of battery chemistries, sizes, and footprints. Device List: 20MM_PTH - Coin Cell Battery Holder - 20mm (PTH) <https://www.sparkfun.com/products/783> 6.8MM_PTH - Coin Cell Battery Holder - 6.8MM(SMD) <https://www.digikey.com/product-detail/en/seiko-instruments/MS621FE-FL11E/728-1057-ND/1889208?WT.srch=1&gclid=CNOQ5a6LzdQCFZS2wAodXCkE0g> 12MM_SMD - Coin Cell Battery Holder - 12mm (SMD) <https://www.sparkfun.com/products/10592> 12MM_PTH - Coin Cell Battery Holder - 12mm (PTH) <https://www.sparkfun.com/products/7948> 20MM_SMD - 20mm Coin Cell Battery Holder (SMD) (2 legs) Used on the Big Time Watch Kit <https://www.sparkfun.com/products/11734> 20MM_SMD_4LEGS - Coin Cell Battery Holder - 20mm (SMD) <https://www.sparkfun.com/products/11892> 20MM_SMD_4LEGS_OVERPASTE - Coin Cell Battery Holder - 20mm (SMD) <https://www.sparkfun.com/products/11892> (Over-paste on the legs) 24.5MM_PTH - Coin Cell Battery Holder - 24.5mm (PTH) <https://www.sparkfun.com/products/8863> 9V - 9V Battery Holder - PC Mount Used on the SparkFun SparkPunk Sound Kit <https://www.sparkfun.com/products/11177> and SparkFun SparkPunk Sequencer Kit <https://www.sparkfun.com/products/12707> 18650 - Battery Holder - 18650 (PTH) <https://www.sparkfun.com/products/13113> AA - Battery Holder - 1xAA (PTH) <https://www.sparkfun.com/products/7949> AAA - Battery Holder - 1xAAA (PTH) <https://www.sparkfun.com/products/12718> AA_KIT - Battery Holder - 1xAA (PTH) <https://www.sparkfun.com/products/7949> Special kit package - pads only have exposed copper on one side of the board. AAA_KIT - Battery Holder - 1xAAA (PTH) <https://www.sparkfun.com/products/12718> Special kit package - pads only have exposed copper on one side of the board.; PROD_ID: BATT-12327; SF_SKU: PRT-13113
C1 C5-C19 C22-C32 = rcl:C-EU: CAPACITOR, European symbol; SPICEPREFIX: C
C2 C3 C21 = SparkFun-Capacitors:10UF: 10.0µF ceramic capacitors A capacitor is a passive two-terminal electrical component used to store electrical energy temporarily in an electric field.; PROD_ID: CAP-11330
C4 C20 = dragino-passive:C-EU: CAPACITOR, European symbol
CN1 = adafruit:USB: USB Connectors USBMINIB - Surface Mount Female Mini-B USB Connector 4UConnector: 06564 By microbuilder.eu Thru-hole RA Female Mini-B USB Connector 4UConnector: 18732 By ladyada.net
D1 D3 = adafruit:DIODE: Diode SMADIODE - SMA Surface Mount Package 20V 1A Schottky Diode Digikey: 641-1014-6-ND DO-1N4148 - Through Hole Small Current Diode SOD-123 20V 1 A (.5mV Vf) Schottky Diode - Digikey: MBRX120TPMSCT-ND SOD-323 10V 570mA (.38mV Vf, 3ns) Schottky Diode - Digikey: ZLLS410CT-ND SOD-523 30V 30mA Schottky Diode (RB751S-40TE61) - Digikey: RB751S-40TE61CT-ND SOT23-R/W - SOT23 Package (R = Solder Paste/Reflow Ovens, W = Hand-Soldering) BAT54Film 40V 300mA - Digikey: 497-7162-1-ND
IC1 IC2 = texas:TPS6306*: HIGH INPUT VOLTAGE BUCK-BOOST CONVERTER WITH 2A SWITCH CURRENT Source: http://www.ti.com/lit/ds/symlink/tps63060.pdf
IC3 = adafruit:MCP73831: MCP73831/2 Miniature Single-Cell, Fully Integrated Li-Ion, Li-Polymer Charge Management Controllers. Nice and small simple lipoly charge controller, with adjustable current and status output (LED) http://www.ladyada.net/library/pcb/eaglelibrary.html
INT1 = microbuilder:HEADER-1X1: PIN HEADER
IPEX1 = dragino-passive:I-PEX: I-PEX, U.F.L connector
JP1 JP4 JP6 = pinhead:PINHD-1X4: PIN HEADER
JP2 = pinhead:PINHD-1X5: PIN HEADER
JP3 = pinhead:PINHD-1X6: PIN HEADER
JP5 = pinhead:PINHD-1X8: PIN HEADER
L1 L2 = Inductor:L: Inductor Fixed - Generic; CATEGORY: Inductor; SUB-CATEGORY: Fixed
Q1 = crystal:FC-12M: kHz RANGE CRYSTAL UNIT LOW PROFILE SMD Source: Epson Toyocom FC-12M.pdf
R1-R13 = rcl:R-EU_: RESISTOR, European symbol; SPICEPREFIX: R
S1 = SparkFun-Switches:MOMENTARY-SWITCH-SPST: Momentary Switch (Pushbutton) - SPST Normally-open (NO) SPST momentary switches (buttons, pushbuttons). Variants PTH-12MM - 12mm square, through-hole Momentary Pushbutton Switch - 12mm Square <https://www.sparkfun.com/products/9190> (COM-09190) PTH-6.0MM, PTH-6.0MM-KIT - 6.0mm square, through-hole Mini Pushbutton Switch <https://www.sparkfun.com/products/97> (COM-00097) KIT package intended for soldering kit's - only one side of pads' copper is exposed. PTH-RIGHT-ANGLE-KIT - Right-angle, through-hole Right Angle Tactile Button <https://www.sparkfun.com/products/10791> - Used on SparkFun BigTime Watch Kit <https://www.sparkfun.com/products/11734> SMD-12MM - 12mm square, surface-mount Tactile Button - SMD (12mm) <https://www.sparkfun.com/products/12993> (COM-12993) Used on SparkFun PicoBoard <https://www.sparkfun.com/products/11888> SMD-4.5MM - 4.5mm Square Trackball Switch Used on SparkFun Blackberry Trackballer Breakout <https://www.sparkfun.com/products/13169> SMD-4.6MMX2.8MM - 4.60mm x 2.80mm, surface mount Used on SparkFun SAMD21 Mini Breakout <https://www.sparkfun.com/products/13664> SMD-5.2MM, SMD-5.2-REDUNDANT - 5.2mm square, surface-mount Mini Pushbutton Switch - SMD <https://www.sparkfun.com/products/8720> (COM-08720) Used on Arduino Pro Mini <https://www.sparkfun.com/products/11114> REDUNDANT package connects both switch circuits together SMD-6.0X3.5MM - 6.0 x 3.5mm, surface mount Momentary Reset Switch SMD <https://www.sparkfun.com/products/8229> (COM-08229) SMD-6.2MM-TALL - 6.2mm square, surface mount Tactile Button - SMD (6mm) <https://www.sparkfun.com/products/12992> Used on SparkFun Digital Sandbox <https://www.sparkfun.com/products/12651> SMD-RIGHT-ANGLE - Right-angle, surface mount Used on SparkFun Block for Intel® Edison - Arduino <https://www.sparkfun.com/products/13036>; PROD_ID: SWCH-08441; SF_SKU: COM-00097
U2 = RFM92_93W:RFM95_98W
U4 = esp32:ESP-WROOM-32
U7 = NXP_60_26022015:PCF8523: The PCF8523 is a CMOS Real-Time Clock (RTC) and calendar optimized for low power consumption. Data is transferred serially via an I2C-bus with a maximum data rate of 1000 kbit/s. Alarm and timer functions are available with the possibility to generate a wake-up signal on an interrupt pin. An offset register allows fine-tuning of the clock. The PCF8523 has a backup battery switch-over circuit, which detects power failures and automatically switches to the battery supply when a power failure occurs. AAL Eindhoven MK; SPICEPREFIX: X
U$16 = adafruit:MICROSD: Micro-SD / Transflash card holder with SPI pinout For the 3M # 2908-05WB-MG and/or 4UCON #19656 push-push type

## Board
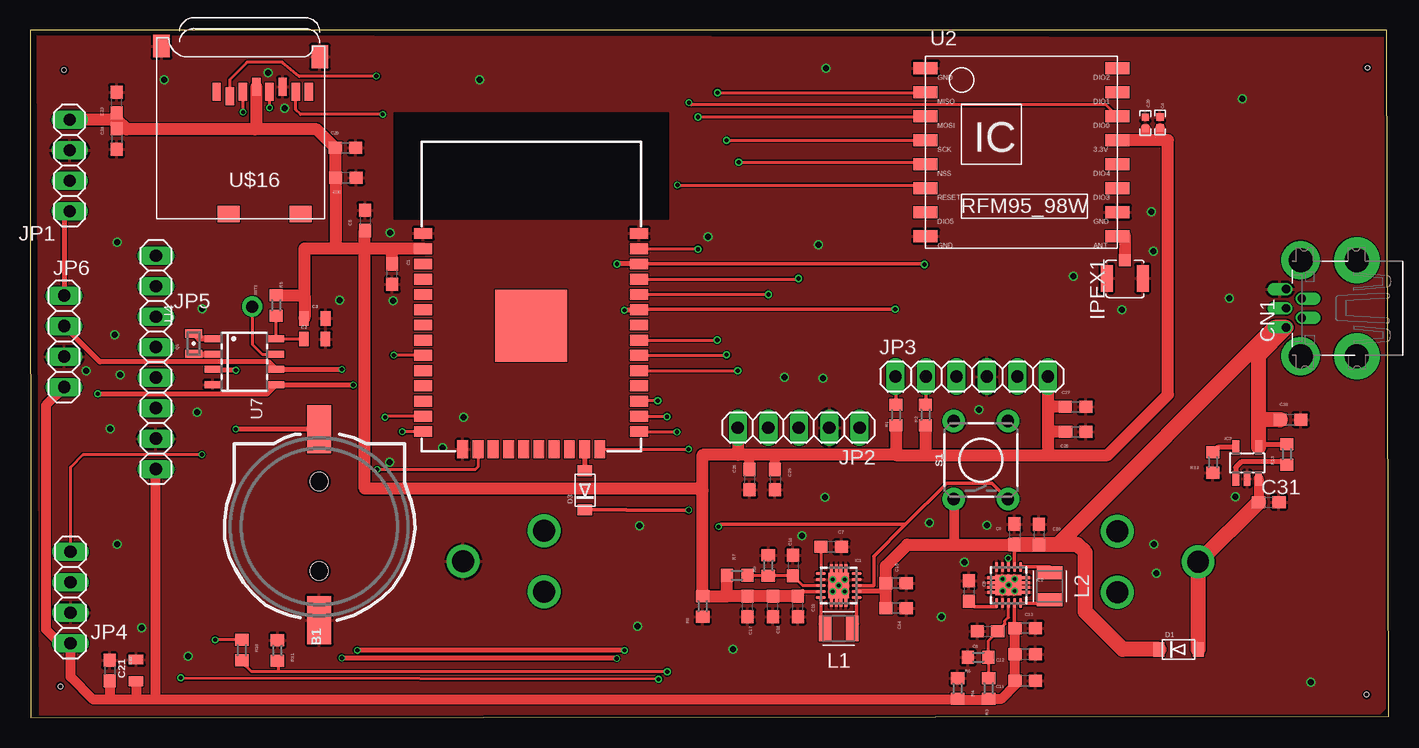
[diagram p11: board, top side]
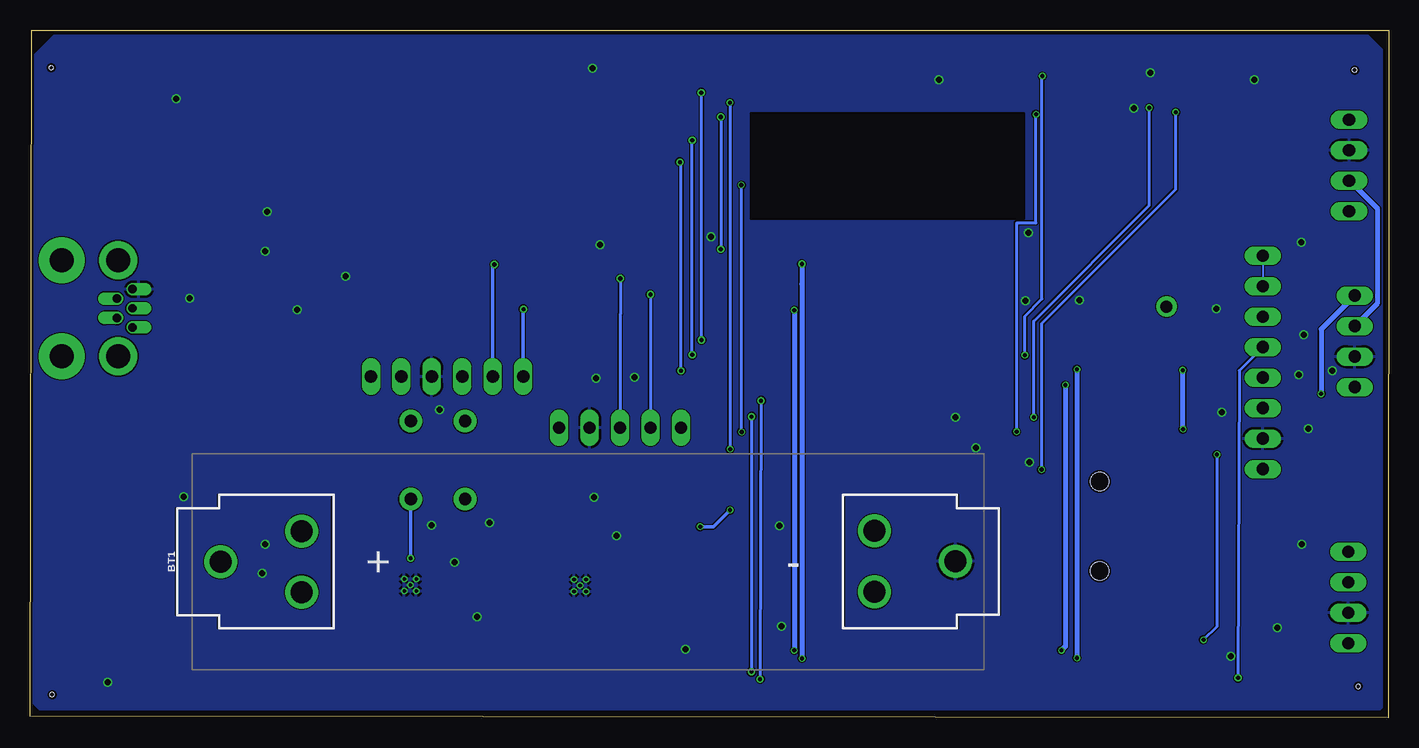
[diagram p12: board, bottom side, seen from below]

Size 113.27 x 57.31 mm. Coordinates in mm from the lower left corner, seen from the top.
Outline: 0.05,0 113.27,0.1 113.12,57.31 0,57.31 0.05,0
Copper layers (1*16): Top 0.018mm / dielectric 1.55mm / Bottom 0.018mm
Design rules "Multi-CB_2L_100µm-Tracks_OL35µm": minimum track width 0.1mm, minimum drill 0.2mm, track to track 0.1mm, track to pad 0.1mm, pad to pad 0.1mm, via to via 0.1mm, smd to smd 0mil, copper to edge 0.2mm, drill to drill 0.2mm, minimum pad ring 0.125mm, minimum via ring 0.1mm, stop-mask expansion 2mil, vias tented up to drill 0.45mm, thermal gap 0.2mm
Holes 0.35 mm at 2.84,53.96 2.54,2.6 111.43,1.92 111.5,54.16

### Footprints (pad centres in the part's own frame; a part is rotated, then mirrored left to right if it is on the bottom)
CR1220-2 = smd 4 x 2: + 8.29,0; - -7.6,0 | hole 1.5: 3.95,0; -3.5,0
BATTERY_18650-HOLDER = drill 1.829: GND@1 30.628,0.01; GND@2 23.88,2.55; GND@3 23.88,-2.53; PWR@1 -30.628,-0.01; PWR@2 -23.88,2.53; PWR@3 -23.88,-2.55
C0603 = smd 1.1 x 1: 1 -0.85,0; 2 0.85,0
0805 = smd 0.8 x 1.2: 1 -0.9,0; 2 0.9,0
C0402 = smd 0.61 x 0.61: 1 -0.457,0; 2 0.457,0
USB-MINIB-THM = drill 0.7 offset: D+ 0,9.8; D- -0.8,8.5; GND 1.6,9.8; ID 0.8,8.5; VBUS -1.6,9.8 | drill 2 pad 3.81: GND1 -4,3.9; GND4 4,3.9 | drill 2 pad 3.2: GND2 -4,8.6; GND3 4,8.6
SOD-123FL = smd 0.91 x 1.22: A 1.637,0; C -1.637,0
DSC-S-PWSON-N10 = smd 0.28 x 0.85: 1 -1,-1.488; 2 -0.5,-1.488; 3 0,-1.488; 4 0.5,-1.488; 5 1,-1.488; 6 1,1.5; 7 0.5,1.5; 8 0,1.5; 9 -0.5,1.5; 10 -1,1.5 | smd 2.15 x 1.7: PP 0,0 | smd 3.55 x 0.25: PP@1 0,0.6; PP@2 0,0.2; PP@3 0,-0.2; PP@4 0,-0.6 | drill 0.3 pad 0.4: PP@5 -0.5,0.5; PP@7 0,0; PP@8 0.5,0.5; PP@9 -0.5,-0.5; PP@10 0.5,-0.5
SOT23-5L = smd 0.55 x 1.2: 1 -0.95,-1.3; 2 0,-1.3; 3 0.95,-1.3; 4 0.95,1.3; 5 -0.95,1.3
1X01_ROUND = drill 1 pad 1.676: 1 0,0
I-PEX = smd 1 x 2.2: GND -1.65,-0.27; GND1 1.35,-0.27 | smd 1 x 1: SIG -0.15,-1.77
1X04 = drill 1.016 long: 1 -3.81,0; 2 -1.27,0; 3 1.27,0; 4 3.81,0
1X05 = drill 1.016 long: 1 -5.08,0; 2 -2.54,0; 3 0,0; 4 2.54,0; 5 5.08,0
1X06 = drill 1.016 long: 1 -6.35,0; 2 -3.81,0; 3 -1.27,0; 4 1.27,0; 5 3.81,0; 6 6.35,0
1X08 = drill 1.016 long: 1 -8.89,0; 2 -6.35,0; 3 -3.81,0; 4 -1.27,0; 5 1.27,0; 6 3.81,0; 7 6.35,0; 8 8.89,0
INDC2520X120N = smd 1.079 x 2.129: 1 -1.125,0; 2 1.125,0
FC-12M = smd 0.7 x 1.4: 1 -0.85,0; 2 0.85,0
R0603 = smd 1 x 1.1: 1 -0.85,0; 2 0.85,0
TACTILE_SWITCH_PTH_6.0MM_KIT = drill 1.016 pad 1.88: 1 -3.251,2.261; 2 3.251,2.261; 3 -3.251,-2.261; 4 3.251,-2.261
RFM95_98W = smd 2 x 1: 1 -8,7; 2 -8,5; 3 -8,3; 4 -8,1; 5 -8,-1; 6 -8,-3; 7 -8,-5; 8 -8,-7; 9 8,-7; 10 8,-5; 11 8,-3; 12 8,-1; 13 8,1; 14 8,3; 15 8,5; 16 8,7
ESP-WROOM-32 = smd 0.9 x 1.5: 1 7.7,9; 2 6.43,9; 3 5.16,9; 4 3.89,9; 5 2.62,9; 6 1.35,9; 7 0.08,9; 8 -1.19,9; 9 -2.46,9; 10 -3.73,9; 11 -5,9; 12 -6.27,9; 13 -7.54,9; 14 -8.81,9; 25 -8.81,-9; 26 -7.54,-9; 27 -6.27,-9; 28 -5,-9; 29 -3.73,-9; 30 -2.46,-9; 31 -1.19,-9; 32 0.08,-9; 33 1.35,-9; 34 2.62,-9; 35 3.89,-9; 36 5.16,-9; 37 6.43,-9; 38 7.7,-9 | smd 1.5 x 0.9: 15 -10.3,5.715; 16 -10.3,4.445; 17 -10.3,3.175; 18 -10.3,1.905; 19 -10.3,0.635; 20 -10.3,-0.635; 21 -10.3,-1.905; 22 -10.3,-3.175; 23 -10.3,-4.445; 24 -10.3,-5.715 | smd 6 x 6: GND 0,0
SOT96-1 = smd 0.6 x 1.3: 1 -1.905,-2.65; 2 -0.635,-2.65; 3 0.635,-2.65; 4 1.905,-2.65; 5 1.905,2.65; 6 0.635,2.65; 7 -0.635,2.65; 8 -1.905,2.65
MICROSD = smd 0.7 x 1.5: 1 9,-10.64; 2 7.9,-10.24; 3 6.8,-10.64; 4 5.7,-11.04; 5 4.6,-10.64; 6 3.5,-11.04; 7 2.4,-10.64; 8 1.3,-10.64 | smd 1.8 x 1.4: CD1 2,-0.44; CD2 8,-0.44 | smd 1.4 x 1.9: MT1 0.4,-13.54; MT2 13.6,-14.44

### Placement (x,y rotation side)
B1  24.11,15.73 90 top
BT1  66.75,13.01 0 bottom
C1  30.2,36.96 90 top
C2  23.73,31.55 180 top
C3  23.75,33.28 180 top
C4  94.2,49.59 270 top
C5  27.92,41.45 270 top
C6  79.82,7.19 0 top
C7  66.79,14.23 180 top
C8  78.27,10.55 270 top
C9  82.07,15.29 270 top
C10  84.1,15.27 270 top
C11  82.97,3.07 180 top
C12  82.97,5.27 180 top
C13  82.97,7.47 180 top
C14  72.19,9.12 180 top
C15  72.19,11.21 180 top
C16  63.61,12.68 270 top
C17  59.82,9.27 90 top
C18  61.92,9.27 90 top
C19  64.02,9.27 90 top
C20  92.98,49.57 270 top
C21  8.85,3.94 270 top
C22  6.64,3.93 270 top
C23  7.23,51.27 90 top
C24  7.22,48.22 270 top
C25  62.12,19.83 270 top
C26  59.98,19.83 270 top
C27  87.17,25.91 0 top
C28  87.18,23.82 0 top
C29  26.31,47.48 0 top
C30  26.33,45 0 top
C31  103.27,17.96 0 top
C32  105.09,24.84 0 top
CN1  114.52,34.12 90 top
D1  95.75,5.68 0 top
D3  46.26,18.96 90 top
IC1  67.42,11.01 90 top
IC2  81.57,11.05 180 top
IC3  101.47,21.23 0 top
INT1  18.52,34.26 90 top
IPEX1  91.12,36.34 180 top
JP1  3.31,46 270 top
JP2  64.09,24.17 180 top
JP3  78.51,28.43 0 top
JP4  3.38,10.02 90 top
JP5  10.49,29.61 270 top
JP6  2.84,31.36 90 top
L1  67.42,7.43 180 top
L2  85,10.95 270 top
Q1  13.64,31.18 270 top
R1  72.2,25.23 90 top
R2  74.65,25.23 90 top
R3  79.92,2.44 270 top
R4  77.33,2.43 270 top
R5  20.53,34.36 270 top
R6  79.05,5.03 0 top
R7  58.95,11.87 180 top
R8  56.08,9.28 90 top
R9  61.54,12.68 270 top
R10  17.66,5.63 90 top
R11  20.63,5.6 270 top
R12  98.61,21.28 90 top
R13  104.78,21.94 90 top
S1  79.26,21.47 90 top
U2  82.65,47.12 0 top
U4  41.79,32.65 90 top
U7  17.88,29.66 270 top
U$16  24.56,41.53 180 top

### Tracks (layer width: path | path; a pad name or v marks a point on that pad's centre or on a via)
3V3
  Top 0.305: IC1.9 64.41,10.51
  Top 0.406: 64.41,10.51 C19.2
  Top 0.813: 58.1,10.22 58.18,10.13 58.19,10.12 | R7.2 | 56.08,21.9 56.08,21.91 | 59.01,21.92 59.02,21.9 | 22.89,33.33 C3.2 | 22.87,35.21 22.89,35.18 | C26.1 59.98,21.87 60.02,21.9 | C25.1 62.12,21.89 62.14,21.9 | C20.2 92.98,48.14 92.96,48.12 | C4.2 94.2,48.17 94.15,48.12
  Top 1.016: C19.2 C18.2 C17.2 58.19,10.12 | 58.1,10.22 R7.2 | 58.18,10.13 R8.2 56.08,18.94 | 56.08,18.94 56.08,21.91 | 72.18,21.9 62.14,21.9 60.02,21.9 59.02,21.9 56.08,21.9 | JP2.5 59.01,21.92 | 22.89,33.33 22.89,35.18 22.89,39.11 22.93,39.08 25.5,39.08 | R5.1 22.87,35.21 | 72.18,21.9 72.18,21.88 74.69,21.88 | 56.08,18.94 55.93,19.08 27.91,19.08 27.91,39.09 | C5.2 27.91,40.59 27.91,39.09 | U4.2 30.21,39.08 | 30.21,39.08 27.92,39.08 | 27.92,39.08 27.91,39.09 | C1.2 30.2,39.06 30.21,39.08 | 27.92,39.08 25.5,39.08 | 25.5,39.08 25.48,39.09 C30.1 25.46,45.03 C29.1 23.91,49.03 18.76,49.03 | U2.13 92.96,48.12 94.15,48.12 94.86,48.12 94.86,26.92 89.81,21.88 84.85,21.88 | 7.19,49.82 JP1.1 | C24.1 7.22,49.79 7.19,49.82 | C23.1 7.23,49.85 | 7.23,49.85 7.19,49.82 | 7.23,49.85 8.04,49.03 18.76,49.03 | U$16.4 18.86,49.13 18.76,49.03 | 74.69,21.88 84.85,21.88 | JP3.6 84.86,25.91 | 84.86,25.91 84.86,23.77 | 84.86,23.77 84.86,21.89 84.85,21.88 | R1.1 72.2,21.92 72.18,21.9 | R2.1 74.65,21.92 74.69,21.88 | C27.1 84.86,25.91 | C28.1 84.9,23.82 84.86,23.77
5V
  Top 0.305: 82.07,7.52 IC2.9
  Top 0.813: 77.25,1.51 10.49,1.51 | 10.49,1.51 8.75,1.51 | 8.75,1.51 6.68,1.51 | 6.68,1.51 5.27,1.51 3.38,3.41 JP4.1 2.46,6.21 1.32,7.35 1.32,26.03 JP6.1 | 82.07,7.52 C13.2 C12.2 C11.2 82.12,2.7 81.01,1.59 R3.2 79.84,1.51 77.25,1.51 | R4.2 77.25,1.51 | 10.49,1.51 JP5.8 | C22.2 6.64,1.56 6.68,1.51 | C21.2 8.84,1.61 8.75,1.51
ANALOG_MQ135(5V)  (via drill 0.35)
  Top 0.254: JP4.4 3.38,20.88 4.41,21.91 14.31,21.91 v14.33,21.93 | R10.2 v15.44,6.48
  Bottom 0.254: v14.33,21.93 14.33,7.6 v15.44,6.48
ANT
  Top 1.016: U2.9 91.27,40.12 IPEX1.SIG
GND  (via drill 0.5)
  other vias: 77.88,12.93 79.78,16.02 75.99,8.43 100.47,18.4 65.74,39.42 58.62,5.71 29.97,21.28 25.81,34.8 21.24,50.77 7.27,39.62 99.97,34.94 93.66,38.87 50.81,16.01 50.63,7.62 34.41,22.5 7.25,14.44 6.69,24.07 13.93,25.45 14.37,34.09 11.21,53.16 56.51,40.08 66.37,54.12 93.49,42.16 101.07,51.57 86.97,36.79 91.01,34.01 37.48,53.18 19.86,53.75 64.36,15.16 106.78,2.96 79.11,25.68 36.13,25.04 13.18,5.1 30.27,34.75 30.02,40.43 93.67,14.44 93.92,12.04 4.69,28.91 9.3,7.48 7.52,28.58 7.08,31.93 62.89,28.37 66.1,28.31 66.27,18.37 74.96,16.23
  pour Bottom: 0.55,55.72 0.55,0.82 0.75,0.62 112.45,0.62 113.05,1.22 113.05,55.12 111.25,56.92 1.75,56.92
  pour Top: 0.55,56.85 0.75,0.26 112.49,0.26 113.05,0.82 113.05,56.65
IO0/RESET  (via drill 0.35)
  Top 0.254: U4.25 53.91,23.84 v53.94,23.81 | v53.97,44.38 74.39,44.38 U2.6
  Bottom 0.254: v53.94,23.81 53.94,44.35 v53.97,44.38
IO2/DIO0  (via drill 0.35)
  Top 0.254: U4.24 54.87,22.35 v54.9,22.38 | v54.93,51.25 55.11,51.06 89.71,51.06 U2.14
  Bottom 0.254: v54.93,51.25 54.93,22.41 v54.9,22.38
IO4/ANALOG  (via drill 0.35 pad 0.6)
  Top 0.254: v53.11,25.09 50.81,25.09 U4.26 | 20.67,3.83 v53.12,3.82 v53.13,3.83 | 20.67,3.83 18.46,3.83 17.66,4.63 R10.1 | R11.2 20.67,4.71 20.67,3.83
  Bottom 0.254: v53.11,25.09 53.11,24.81 53.13,24.8 v53.13,3.83
IO5  (via drill 0.35 pad 0.6)
  Top 0.254: U4.29 v59,28.92 | v59.09,46.3 74.47,46.3 U2.5
  Bottom 0.254: v59,28.92 59,46.21 v59.09,46.3
IO12/HSPI-MISO  (via drill 0.35)
  Top 0.254: U4.14 | U4.14 v31.03,23.84 | v29.4,50.28 22.55,50.28 22.16,50.67 U$16.7
  Bottom 0.254: v31.03,23.84 31.03,23.94 31.03,41.23 29.4,41.23 v29.4,50.28
IO13/HSPI-MOSI  (via drill 0.35)
  Top 0.254: U4.16 37.34,20.9 37.12,20.67 29.72,20.67 29.72,20.68 v28.94,20.68 | v17.76,50.46 v17.76,50.47 U$16.3
  Bottom 0.254: v17.76,50.46 17.76,44.02 28.9,32.89 28.9,20.72 v28.94,20.68
IO14/HSPI-CLK  (via drill 0.35)
  Top 0.254: U4.13 29.67,25.11 v29.6,25.04 | v19.97,50.83 U$16.5
  Bottom 0.254: v29.6,25.04 29.6,33.06 19.97,42.69 v19.97,50.83
IO15/VCC_ENABLE
  Top 0.406: D3.A 46.26,22.32 U4.23
IO16/U2RX  (via drill 0.35 pad 0.6)
  Top 0.254: v52.41,3.21 52.39,3.19 12.57,3.27 v12.57,3.32 | v52.33,26.41 50.82,26.41 U4.27
  Bottom 0.254: v12.57,3.32 12.58,3.33 12.46,28.92 JP5.4 | v52.33,26.41 v52.41,3.2 v52.41,3.21
IO18/SCK  (via drill 0.35 pad 0.6)
  Top 0.254: U4.30 58.02,30.19 v58.07,30.24 | v58.07,48.11 74.64,48.11 U2.4
  Bottom 0.254: v58.07,30.24 v58.07,48.11
IO19/MISO  (via drill 0.35 pad 0.6)
  Top 0.254: U4.31 v57.29,31.46 v57.29,31.47 | v57.31,52.09 74.62,52.09 U2.2
  Bottom 0.254: v57.29,31.47 57.29,52.07 v57.31,52.09
IO21/SDA  (via drill 0.35, 0.35 pad 0.6)
  Top 0.254: U4.33 50.74,33.95
  Top 0.305: JP3.1 72.2,28.39 R1.2 | v72.13,34.04 50.83,34.04 U4.33
  Top 0.406: JP1.4 2.84,41.73 JP6.4 | v5.64,26.99 19.77,26.99 U7.5 26.91,27.76 v26.95,27.72 | v49.56,5.61 v27.29,5.61 | 50.74,33.95 v49.56,33.95
  Bottom 0.305: JP3.1 72.15,34.02 v72.13,34.04
  Bottom 0.406: v5.64,26.99 5.64,32.37 JP6.4 | v26.95,27.72 26.95,5.95 v27.29,5.61 | v49.56,33.95 v49.56,5.62 v49.56,5.61
IO22/SCL  (via drill 0.35, 0.35 pad 0.6)
  Top 0.254: v48.93,37.81 v48.92,37.81 | 74.53,37.81 v74.56,37.77
  Top 0.305: U4.36 74.53,37.81 | JP3.2 74.7,26.13 R2.2
  Top 0.406: U4.36 v48.93,37.81 | v25.99,29.03 U7.6 19.91,29.64 5.83,29.64 JP6.3 | v48.91,4.93 26.04,4.93 v25.99,4.98
  Bottom 0.254: v74.56,37.77 v74.55,37.76 74.55,37.75
  Bottom 0.305: 74.55,37.75 74.7,37.61 JP3.2
  Bottom 0.406: JP6.3 0.93,34.55 0.93,42.4 3.27,44.74 JP1.3 | v48.92,37.81 48.92,36.14 48.93,36.14 48.93,4.95 v48.91,4.93 | v25.99,29.03 v25.99,4.98
IO23/MOSI  (via drill 0.35 pad 0.6)
  Top 0.254: U4.37 55.65,39.08 v55.69,39.05 | v55.69,50.06 74.59,50.06 U2.3
  Bottom 0.254: v55.69,50.06 v55.69,39.05
IO33/CS  (via drill 0.35)
  Top 0.254: U4.9 30.36,30.19 v30.33,30.21 | v28.88,53.47 28.86,53.46 22.45,53.44 21.03,54.63 18.1,54.63 16.65,53.18 U$16.2
  Bottom 0.254: v30.33,30.21 30.33,33.47 28.9,34.9 28.9,53.45 v28.88,53.47
N$1
  Top 0.254: INT1.1 18.52,31.11 19.34,30.3 U7.7
N$2
  Top 0.406: IC3.5 99.01,22.53 R12.2
N$3
  Top 0.813: IC3.3 C31.1
  Top 1.27: D1.A BT1.PWR@1 | BT1.PWR@1 | C31.1 97.46,12.99 BT1.PWR@1
N$4
  Top 0.305: IC2.6 80.57,9.26 78.72,9.26 C8.2
N$5
  Top 0.254: C7.2 65.94,12.03 IC1.6
N$6
  Top 0.254: 81.57,14.41 81.58,14.42
  Top 0.305: IC2.2 C9.2 | 71.13,11 C15.2
  Top 0.406: IC1.2 71.29,10.52 71.34,10.46 | IC3.4 102.68,22.79 R13.2
  Top 0.813: 81.58,14.42 82.09,14.42 | S1.1 77,14.43 76.99,14.42 | C15.2
  Top 1.016: 82.09,14.42 C9.2 | C14.2 71.34,10.46 C15.2 71.34,12.63 73.13,14.42 76.99,14.42 81.58,14.42
  Top 1.27: 82.09,14.42 C10.2 85.67,14.42 | D1.C 91.09,5.68 87.96,8.81 87.96,13.78 87.32,14.42 85.67,14.42 | 85.67,14.42 103.77,32.52 CN1.VBUS 102.42,30.22 102.42,24.83 | IC3.4 102.42,24.83 | C32.1 104.22,24.83 102.42,24.83
N$7
  Top 0.305: IC2.10 84.74,9.55 L2.2
N$8
  Top 0.305: IC1.1 68.91,7.8
  Top 0.406: 68.91,7.8 L1.1
N$9
  Top 0.305: IC1.10 65.92,7.8
  Top 0.406: 65.92,7.8 L1.2
N$10
  Top 0.254: IC2.8 81.57,8.36 81.29,8.08 81.29,7.81 C6.2 79.9,6.42 R6.2 79.92,5.01 R3.1
N$11
  Top 0.254: IC1.8 64.42,11.01 C16.2 R9.2 59.84,11.83 R7.1
N$13
  Top 0.305: IC2.1 82.59,12.56 85,12.56 L2.1
N$14
  Top 0.406: R13.1 104.55,21.32 100.98,21.32 100.52,20.86 IC3.1 | IC3.1
N$24
  Top 0.508: U7.1 14.1,31.57 Q1.1
N$28
  Top 0.508: Q1.2 13.67,30.3 U7.2
N$30  (via drill 0.35)
  Top 0.406: B1.+ 17.18,24.02 v17.15,24.04 | v17.17,28.95 15.3,28.95 U7.3
  Bottom 0.406: v17.15,24.04 17.15,28.94 v17.17,28.95
N$31
  Top 0.254: R5.2 U7.8 20.55,31.55 C2.2
NG
  Bottom 0.152: JP5.1 JP5.2
RXD0  (via drill 0.35 pad 0.6)
  Top 0.254: U4.34 v61.54,35.27 v61.55,35.26
  Bottom 0.254: v61.55,35.26 JP2.4
SCHALTER  (via drill 0.35)
  Top 0.305: v81.54,13.29 81.57,13.26 IC2.3 | S1.3 80.19,19.55 76.42,19.55 72.99,16.12 | 72.99,16.12 57.6,16.12 v57.41,15.92 | IC1.3 70.3,11.01 70.33,11.04 70.33,13.46 72.99,16.12 | v54.91,17.3 49.69,17.3 49.67,17.32 D3.C
  Bottom 0.305: S1.3 81.52,13.31 v81.54,13.29 | v57.41,15.92 56.29,15.92 v54.91,17.3
TXD0  (via drill 0.35 pad 0.6)
  Top 0.254: U4.35 64,36.54 v64.06,36.6
  Bottom 0.254: JP2.3 64.07,24.19 64.07,33.62 64.06,33.63 v64.06,36.6